# EAGLE design Motherboard (EAGLE 6.5.0)

## Sheet 1 of 6: Power
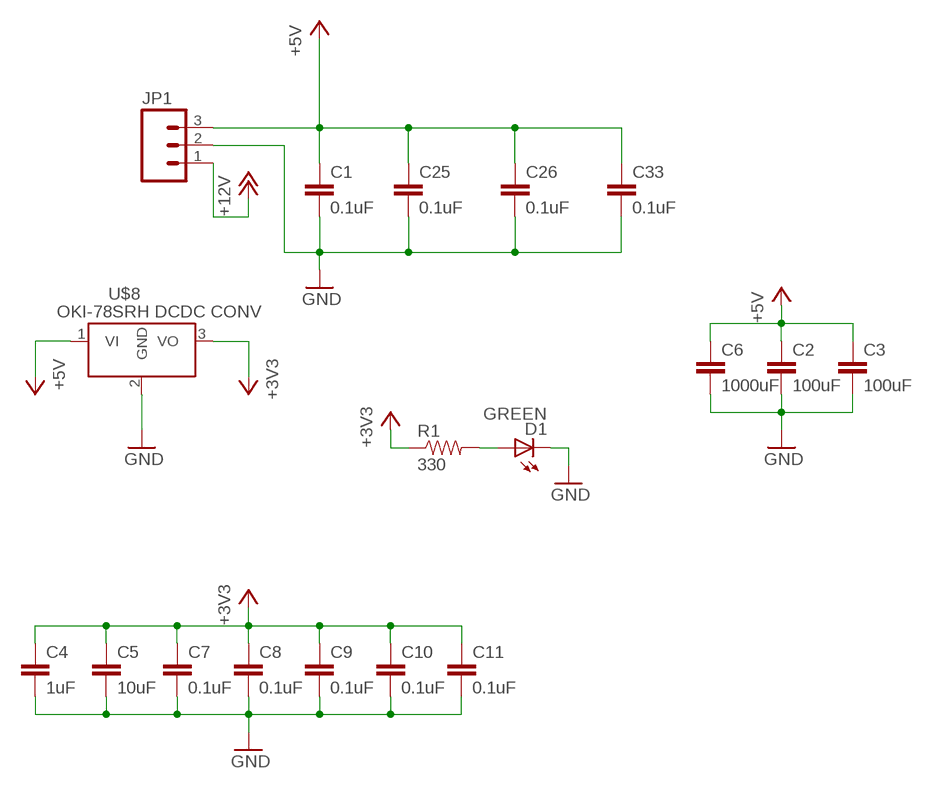
[diagram p0: schematic, sheet 1]

### Parts
C1  0.1uF  CAP1206  [1206]
C2  100uF  CAP1206  [1206]
C3  100uF  CAP1206  [1206]
C4  1uF  CAP1206  [1206]
C5  10uF  CAP1206  [1206]
C6  1000uF  CAP1206  [1206]
C7  0.1uF  CAP1206  [1206]
C8  0.1uF  CAP1206  [1206]
C9  0.1uF  CAP1206  [1206]
C10  0.1uF  CAP1206  [1206]
C11  0.1uF  CAP1206  [1206]
C25  0.1uF  CAP1206  [1206]
C26  0.1uF  CAP1206  [1206]
C33  0.1uF  CAP1206  [1206]
D1  GREEN  LED-GREENLARGE  [LED-1206]
JP1  M03SCREW  [SCREWTERMINAL-3.5MM-3]
R1  330  RESISTOR1206  [1206]
U$8  Q_OKI-78SR  [OKI-78SRH]

### Nets
5V: C1.1 C2.1 C3.1 C6.1 C25.1 C26.1 C33.1 JP1.3 U$8.1(VI) ; supply symbol labelled +5V ; also sheet 5
+3V3: C4.1 C5.1 C7.1 C8.1 C9.1 C10.1 C11.1 R1.1 U$8.3(VO) ; also sheet 3,4,5
+12V: JP1.1 ; also sheet 2
GND: C1.2 C2.2 C3.2 C4.2 C5.2 C6.2 C7.2 C8.2 C9.2 C10.2 C11.2 C25.2 C26.2 C33.2 D1.C JP1.2 U$8.2(GND) ; also sheet 2,3,4,5,6
N$45: D1.A R1.2

## Sheet 2 of 6: Fans
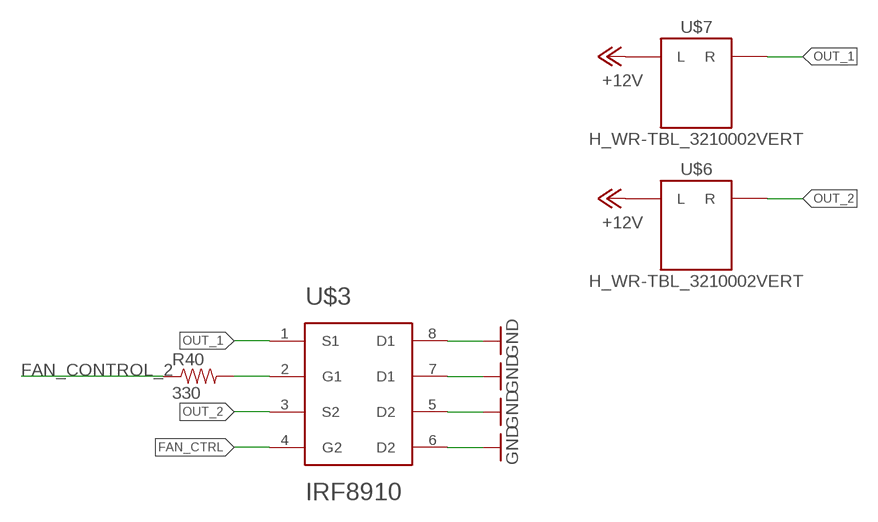
[diagram p1: schematic, sheet 2]

### Parts
R40  330  RESISTOR1206  [1206]
U$3  IRF8910  [SO8]
U$6  H_WR-TBL_3210002VERT  [691321100002]
U$7  H_WR-TBL_3210002VERT  [691321100002]

### Nets
+12V: U$6.L U$7.L ; also sheet 1
FAN_CONTROL_2: R40.1 ; also sheet 3
FAN_CTRL: R40.2 U$3.2(G1) U$3.4(G2)
GND: U$3.5(D2) U$3.6(D2) U$3.7(D1) U$3.8(D1) ; also sheet 1,3,4,5,6
OUT_1: U$3.1(S1) U$7.R
OUT_2: U$3.3(S2) U$6.R

## Sheet 3 of 6: Launchpad
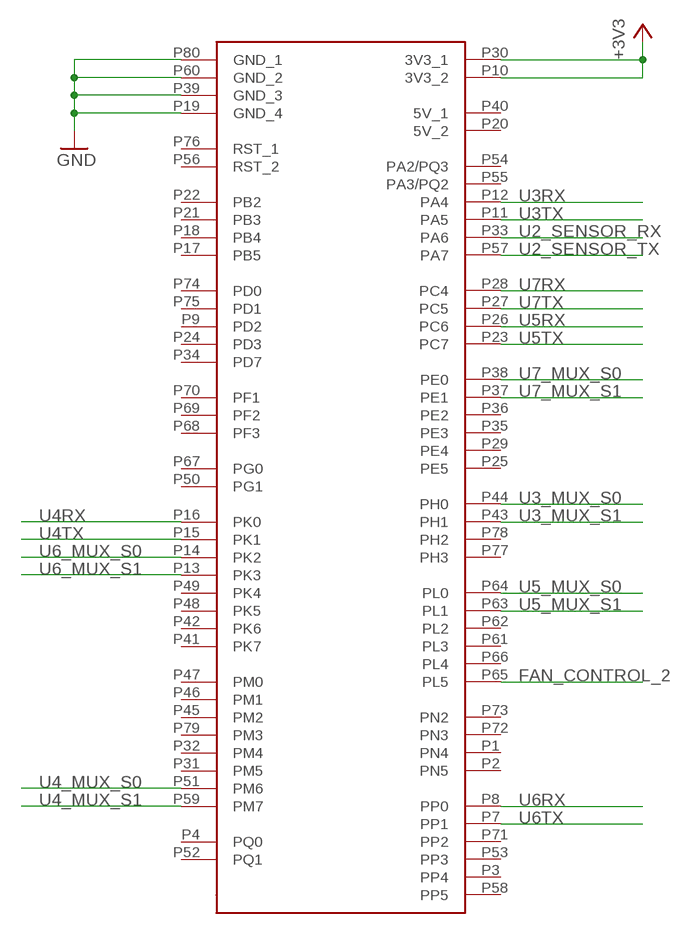
[diagram p2: schematic, sheet 3]

### Parts
U$5  STELLARISLAUNCHPAD_CONNECTED  [STELLARISLAUNCHPAD_CONNECTED]

### Nets
+3V3: U$5.P10(3V3_2) U$5.P30(3V3_1) ; also sheet 1,4,5
FAN_CONTROL_2: U$5.P65(PL5) ; also sheet 2
GND: U$5.P19(GND_4) U$5.P39(GND_3) U$5.P60(GND_2) U$5.P80(GND_1) ; also sheet 1,2,4,5,6
U2_SENSOR_RX: U$5.P33(PA6) ; also sheet 5
U2_SENSOR_TX: U$5.P57(PA7) ; also sheet 5
U3_MUX_S0: U$5.P44(PH0) ; also sheet 4
U3_MUX_S1: U$5.P43(PH1) ; also sheet 4
U3RX: U$5.P12(PA4) ; also sheet 4
U3TX: U$5.P11(PA5) ; also sheet 4
U4_MUX_S0: U$5.P51(PM6) ; also sheet 4
U4_MUX_S1: U$5.P59(PM7) ; also sheet 4
U4RX: U$5.P16(PK0) ; also sheet 4
U4TX: U$5.P15(PK1) ; also sheet 4
U5_MUX_S0: U$5.P64(PL0) ; also sheet 4
U5_MUX_S1: U$5.P63(PL1) ; also sheet 4
U5RX: U$5.P26(PC6) ; also sheet 4
U5TX: U$5.P23(PC7) ; also sheet 4
U6_MUX_S0: U$5.P14(PK2) ; also sheet 4
U6_MUX_S1: U$5.P13(PK3) ; also sheet 4
U6RX: U$5.P8(PP0) ; also sheet 4
U6TX: U$5.P7(PP1) ; also sheet 4
U7_MUX_S0: U$5.P38(PE0) ; also sheet 4
U7_MUX_S1: U$5.P37(PE1) ; also sheet 4
U7RX: U$5.P28(PC4) ; also sheet 4
U7TX: U$5.P27(PC5) ; also sheet 4
Unconnected: U$5.P1(PN4) U$5.P2(PN5) U$5.P3(PP4) U$5.P4(PQ0) U$5.P9(PD2) U$5.P17(PB5) U$5.P18(PB4) U$5.P20(5V_2) U$5.P21(PB3) U$5.P22(PB2) U$5.P24(PD3) U$5.P25(PE5) U$5.P29(PE4) U$5.P31(PM5) U$5.P32(PM4) U$5.P34(PD7) U$5.P35(PE3) U$5.P36(PE2) U$5.P40(5V_1) U$5.P41(PK7) U$5.P42(PK6) U$5.P45(PM2) U$5.P46(PM1) U$5.P47(PM0) U$5.P48(PK5) U$5.P49(PK4) U$5.P50(PG1) U$5.P52(PQ1) U$5.P53(PP3) U$5.P54(PA2/PQ3) U$5.P55(PA3/PQ2) U$5.P56(RST_2) U$5.P58(PP5) U$5.P61(PL3) U$5.P62(PL2) U$5.P66(PL4) U$5.P67(PG0) U$5.P68(PF3) U$5.P69(PF2) U$5.P70(PF1) U$5.P71(PP2) U$5.P72(PN3) U$5.P73(PN2) U$5.P74(PD0) U$5.P75(PD1) U$5.P76(RST_1) U$5.P77(PH3) U$5.P78(PH2) U$5.P79(PM3)

## Sheet 4 of 6: Muxes
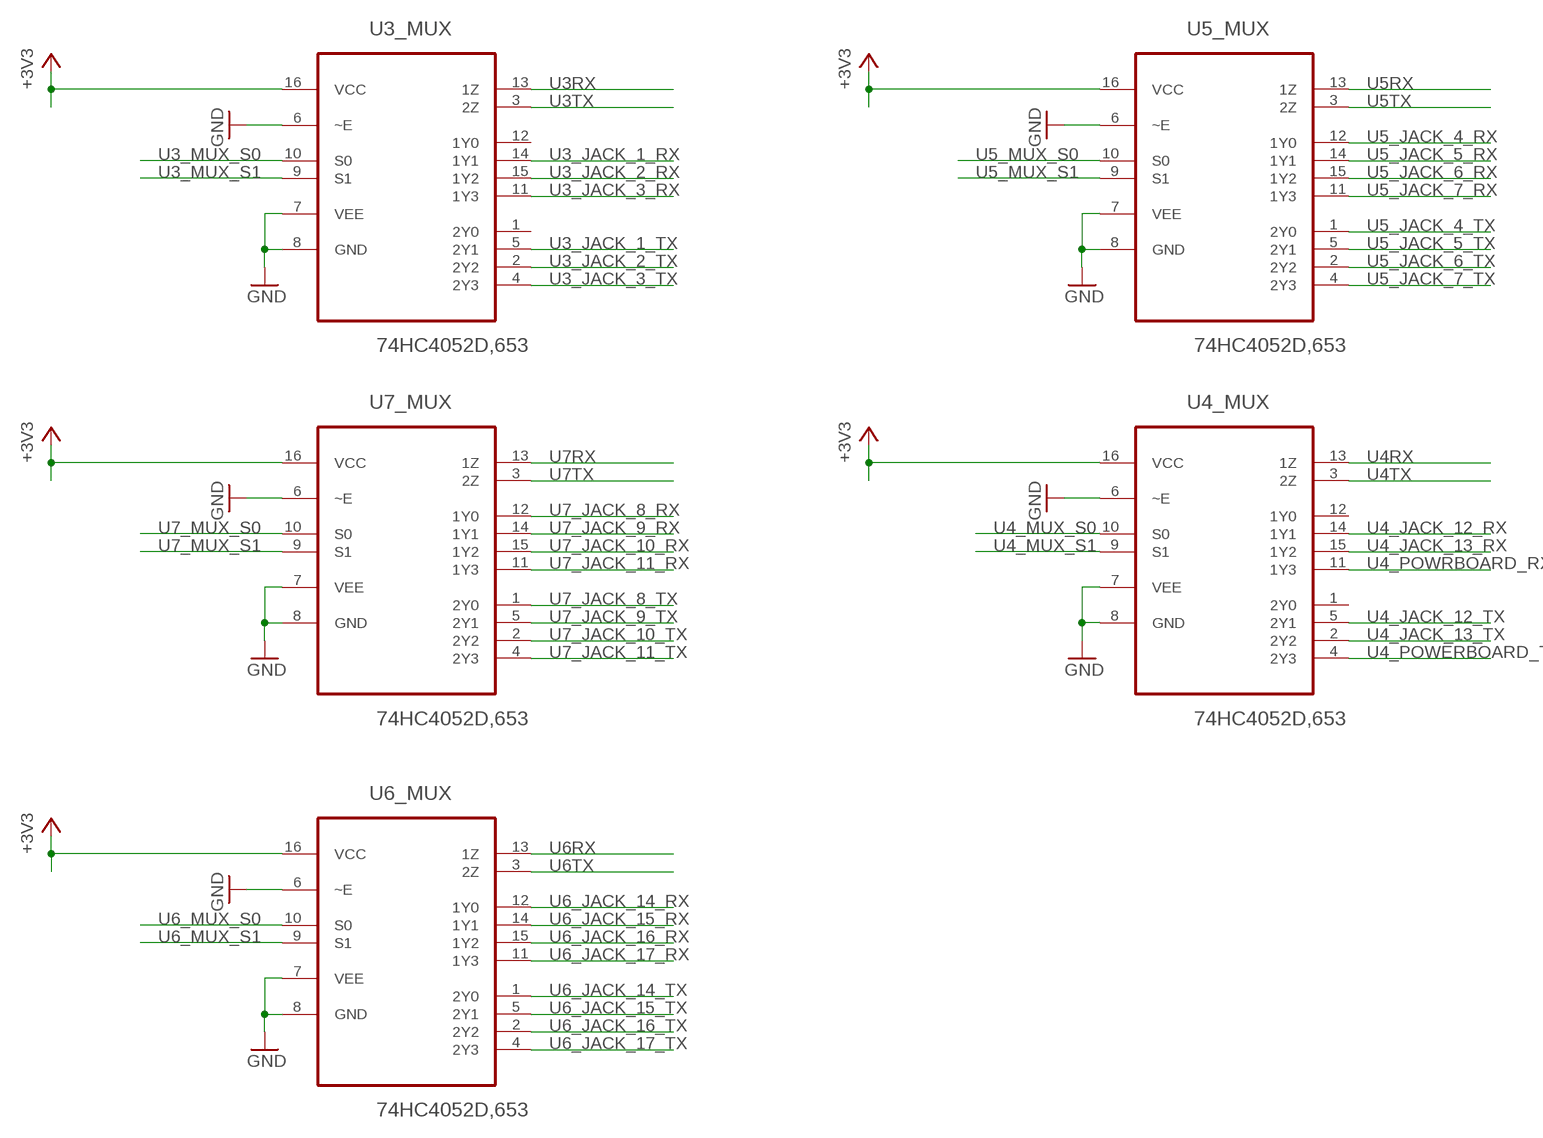
[diagram p3: schematic, sheet 4]

### Parts
U3_MUX  74HC4052D,653  [SOIC127P600X175-16N]
U4_MUX  74HC4052D,653  [SOIC127P600X175-16N]
U5_MUX  74HC4052D,653  [SOIC127P600X175-16N]
U6_MUX  74HC4052D,653  [SOIC127P600X175-16N]
U7_MUX  74HC4052D,653  [SOIC127P600X175-16N]

### Nets
+3V3: U3_MUX.16(VCC) U4_MUX.16(VCC) U5_MUX.16(VCC) U6_MUX.16(VCC) U7_MUX.16(VCC) ; also sheet 1,3,5
GND: U3_MUX.6(~E) U3_MUX.7(VEE) U3_MUX.8(GND) U4_MUX.6(~E) U4_MUX.7(VEE) U4_MUX.8(GND) U5_MUX.6(~E) U5_MUX.7(VEE) U5_MUX.8(GND) U6_MUX.6(~E) U6_MUX.7(VEE) U6_MUX.8(GND) U7_MUX.6(~E) U7_MUX.7(VEE) U7_MUX.8(GND) ; also sheet 1,2,3,5,6
U3_JACK_1_RX: U3_MUX.14(1Y1) ; also sheet 5
U3_JACK_1_TX: U3_MUX.5(2Y1) ; also sheet 5
U3_JACK_2_RX: U3_MUX.15(1Y2) ; also sheet 5
U3_JACK_2_TX: U3_MUX.2(2Y2) ; also sheet 5
U3_JACK_3_RX: U3_MUX.11(1Y3) ; also sheet 5
U3_JACK_3_TX: U3_MUX.4(2Y3) ; also sheet 5
U3_MUX_S0: U3_MUX.10(S0) ; also sheet 3
U3_MUX_S1: U3_MUX.9(S1) ; also sheet 3
U3RX: U3_MUX.13(1Z) ; also sheet 3
U3TX: U3_MUX.3(2Z) ; also sheet 3
U4_JACK_12_RX: U4_MUX.14(1Y1) ; also sheet 5
U4_JACK_12_TX: U4_MUX.5(2Y1) ; also sheet 5
U4_JACK_13_RX: U4_MUX.15(1Y2) ; also sheet 5
U4_JACK_13_TX: U4_MUX.2(2Y2) ; also sheet 5
U4_MUX_S0: U4_MUX.10(S0) ; also sheet 3
U4_MUX_S1: U4_MUX.9(S1) ; also sheet 3
U4_POWERBOARD_TX: U4_MUX.4(2Y3) ; also sheet 5
U4_POWRBOARD_RX: U4_MUX.11(1Y3) ; also sheet 5
U4RX: U4_MUX.13(1Z) ; also sheet 3
U4TX: U4_MUX.3(2Z) ; also sheet 3
U5_JACK_4_RX: U5_MUX.12(1Y0) ; also sheet 5
U5_JACK_4_TX: U5_MUX.1(2Y0) ; also sheet 5
U5_JACK_5_RX: U5_MUX.14(1Y1) ; also sheet 5
U5_JACK_5_TX: U5_MUX.5(2Y1) ; also sheet 5
U5_JACK_6_RX: U5_MUX.15(1Y2) ; also sheet 5
U5_JACK_6_TX: U5_MUX.2(2Y2) ; also sheet 5
U5_JACK_7_RX: U5_MUX.11(1Y3) ; also sheet 5
U5_JACK_7_TX: U5_MUX.4(2Y3) ; also sheet 5
U5_MUX_S0: U5_MUX.10(S0) ; also sheet 3
U5_MUX_S1: U5_MUX.9(S1) ; also sheet 3
U5RX: U5_MUX.13(1Z) ; also sheet 3
U5TX: U5_MUX.3(2Z) ; also sheet 3
U6_JACK_14_RX: U6_MUX.12(1Y0) ; also sheet 5
U6_JACK_14_TX: U6_MUX.1(2Y0) ; also sheet 5
U6_JACK_15_RX: U6_MUX.14(1Y1) ; also sheet 5
U6_JACK_15_TX: U6_MUX.5(2Y1) ; also sheet 5
U6_JACK_16_RX: U6_MUX.15(1Y2) ; also sheet 5
U6_JACK_16_TX: U6_MUX.2(2Y2) ; also sheet 5
U6_JACK_17_RX: U6_MUX.11(1Y3) ; also sheet 5
U6_JACK_17_TX: U6_MUX.4(2Y3) ; also sheet 5
U6_MUX_S0: U6_MUX.10(S0) ; also sheet 3
U6_MUX_S1: U6_MUX.9(S1) ; also sheet 3
U6RX: U6_MUX.13(1Z) ; also sheet 3
U6TX: U6_MUX.3(2Z) ; also sheet 3
U7_JACK_8_RX: U7_MUX.12(1Y0) ; also sheet 5
U7_JACK_8_TX: U7_MUX.1(2Y0) ; also sheet 5
U7_JACK_9_RX: U7_MUX.14(1Y1) ; also sheet 5
U7_JACK_9_TX: U7_MUX.5(2Y1) ; also sheet 5
U7_JACK_10_RX: U7_MUX.15(1Y2) ; also sheet 5
U7_JACK_10_TX: U7_MUX.2(2Y2) ; also sheet 5
U7_JACK_11_RX: U7_MUX.11(1Y3) ; also sheet 5
U7_JACK_11_TX: U7_MUX.4(2Y3) ; also sheet 5
U7_MUX_S0: U7_MUX.10(S0) ; also sheet 3
U7_MUX_S1: U7_MUX.9(S1) ; also sheet 3
U7RX: U7_MUX.13(1Z) ; also sheet 3
U7TX: U7_MUX.3(2Z) ; also sheet 3
Unconnected: U3_MUX.1(2Y0) U3_MUX.12(1Y0) U4_MUX.1(2Y0) U4_MUX.12(1Y0)

## Sheet 5 of 6: RS-485 External
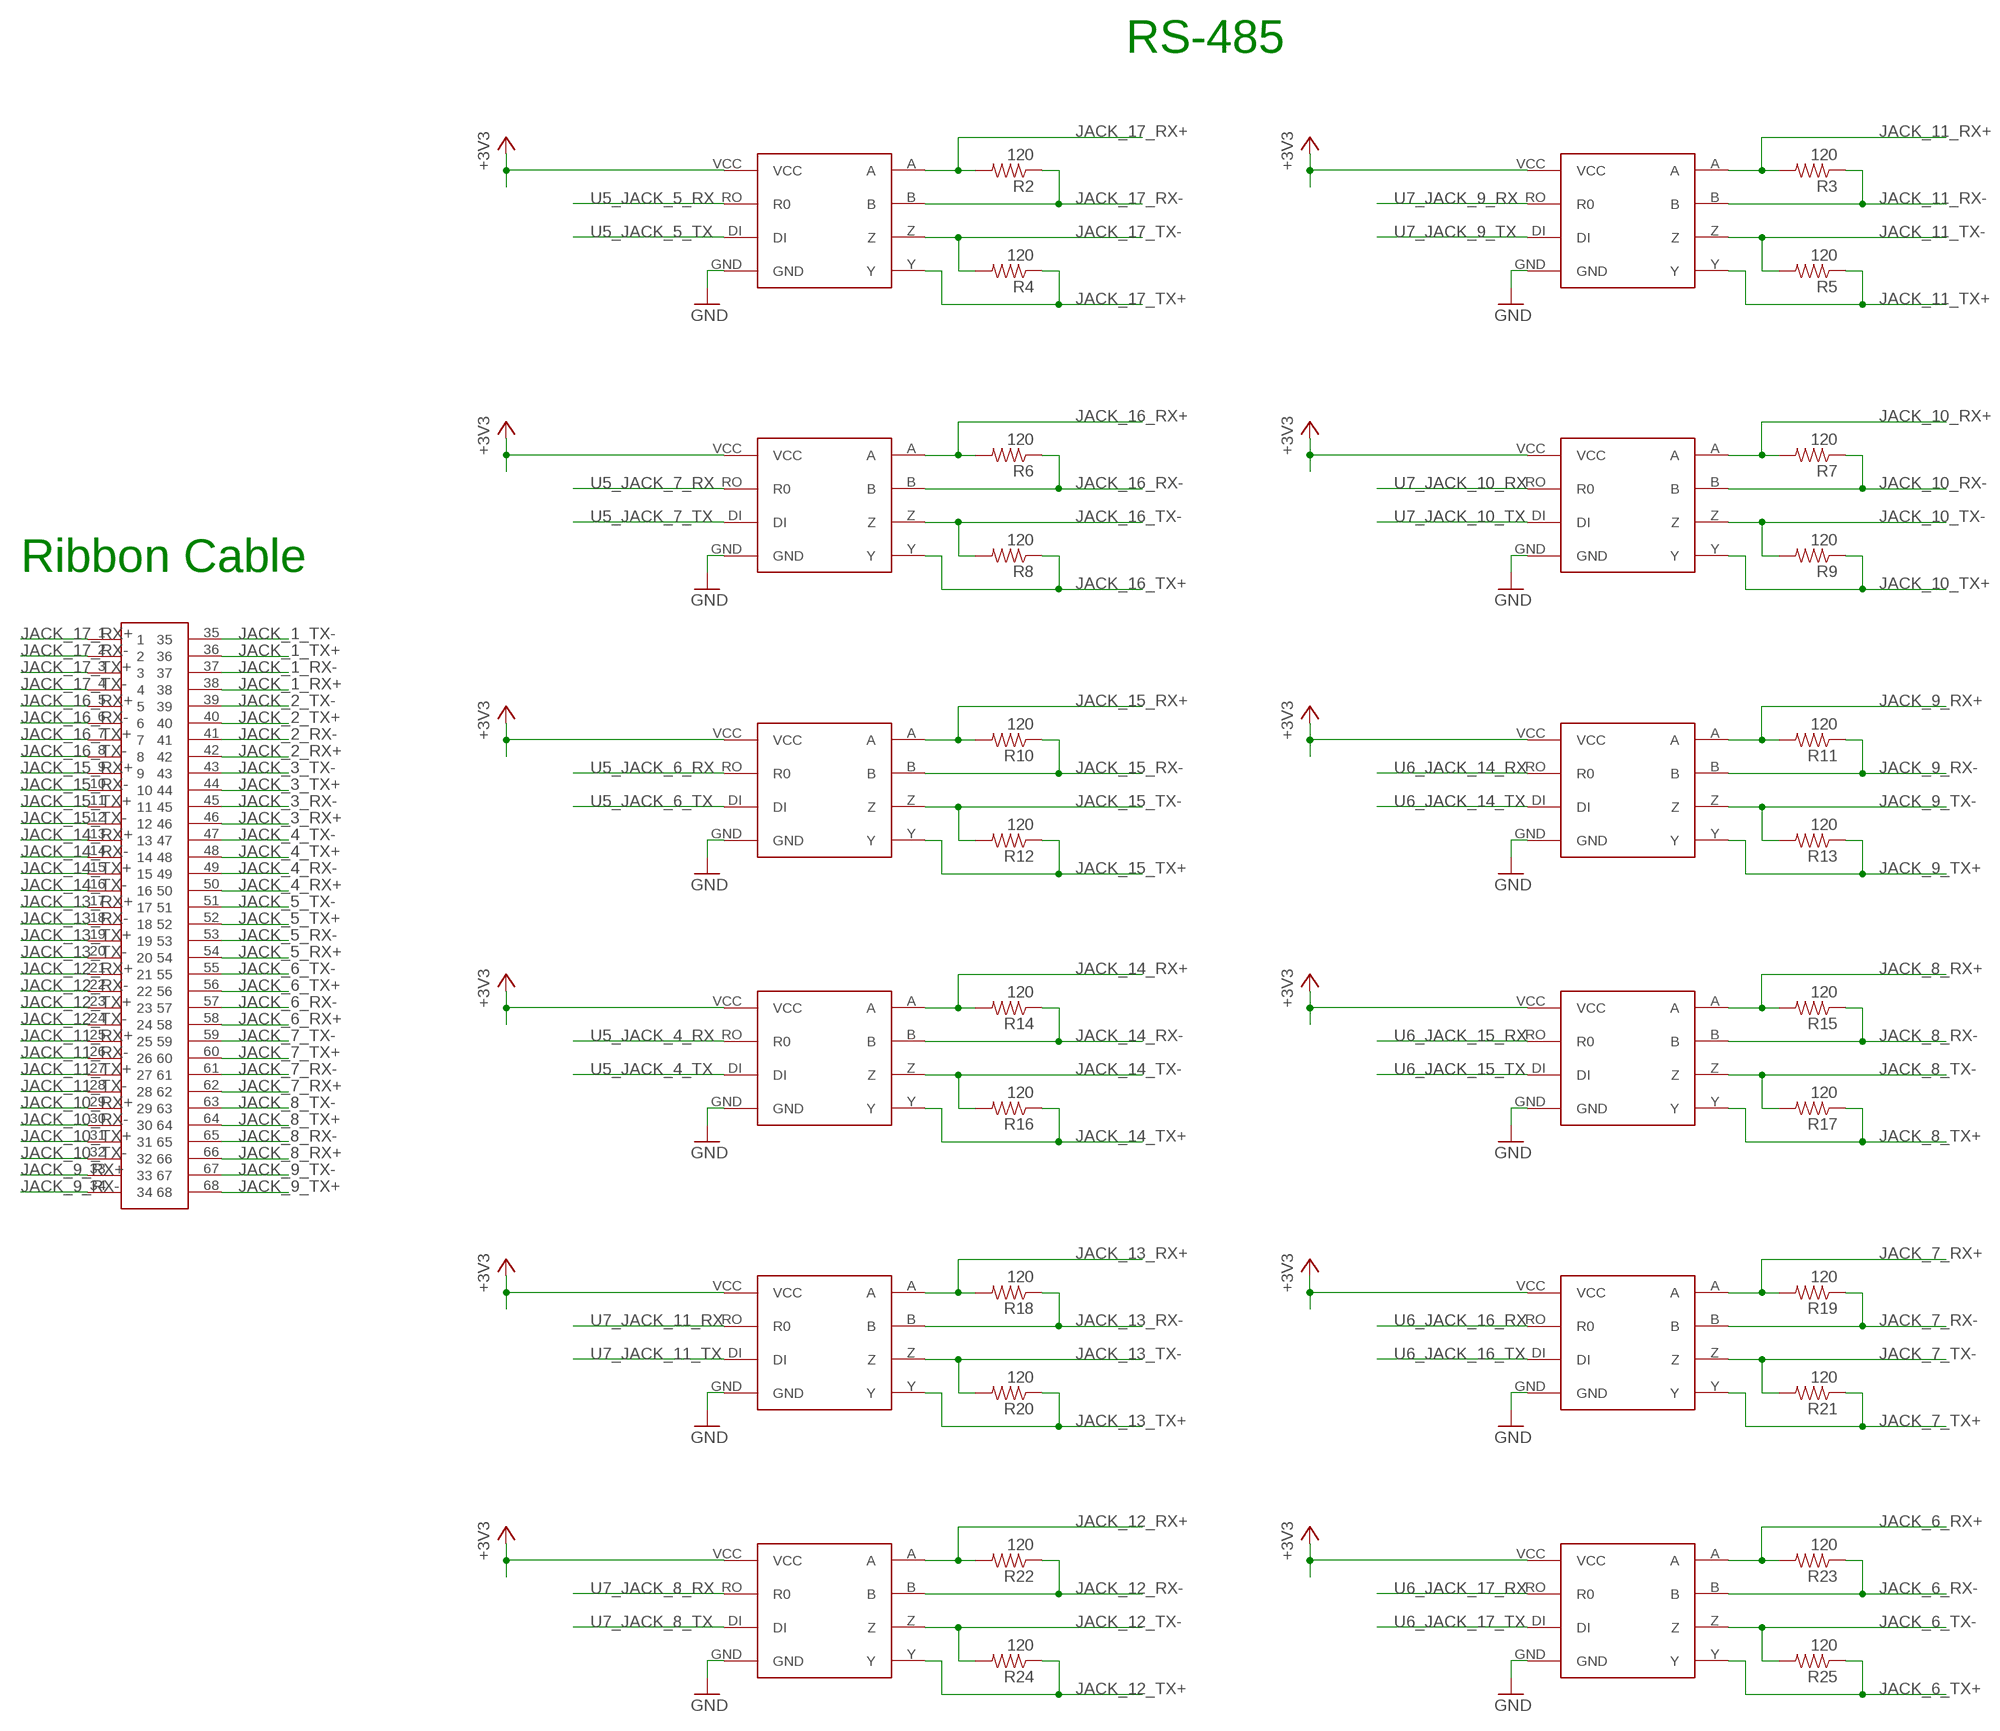
[diagram p4: schematic, sheet 5, part 1 of 2]
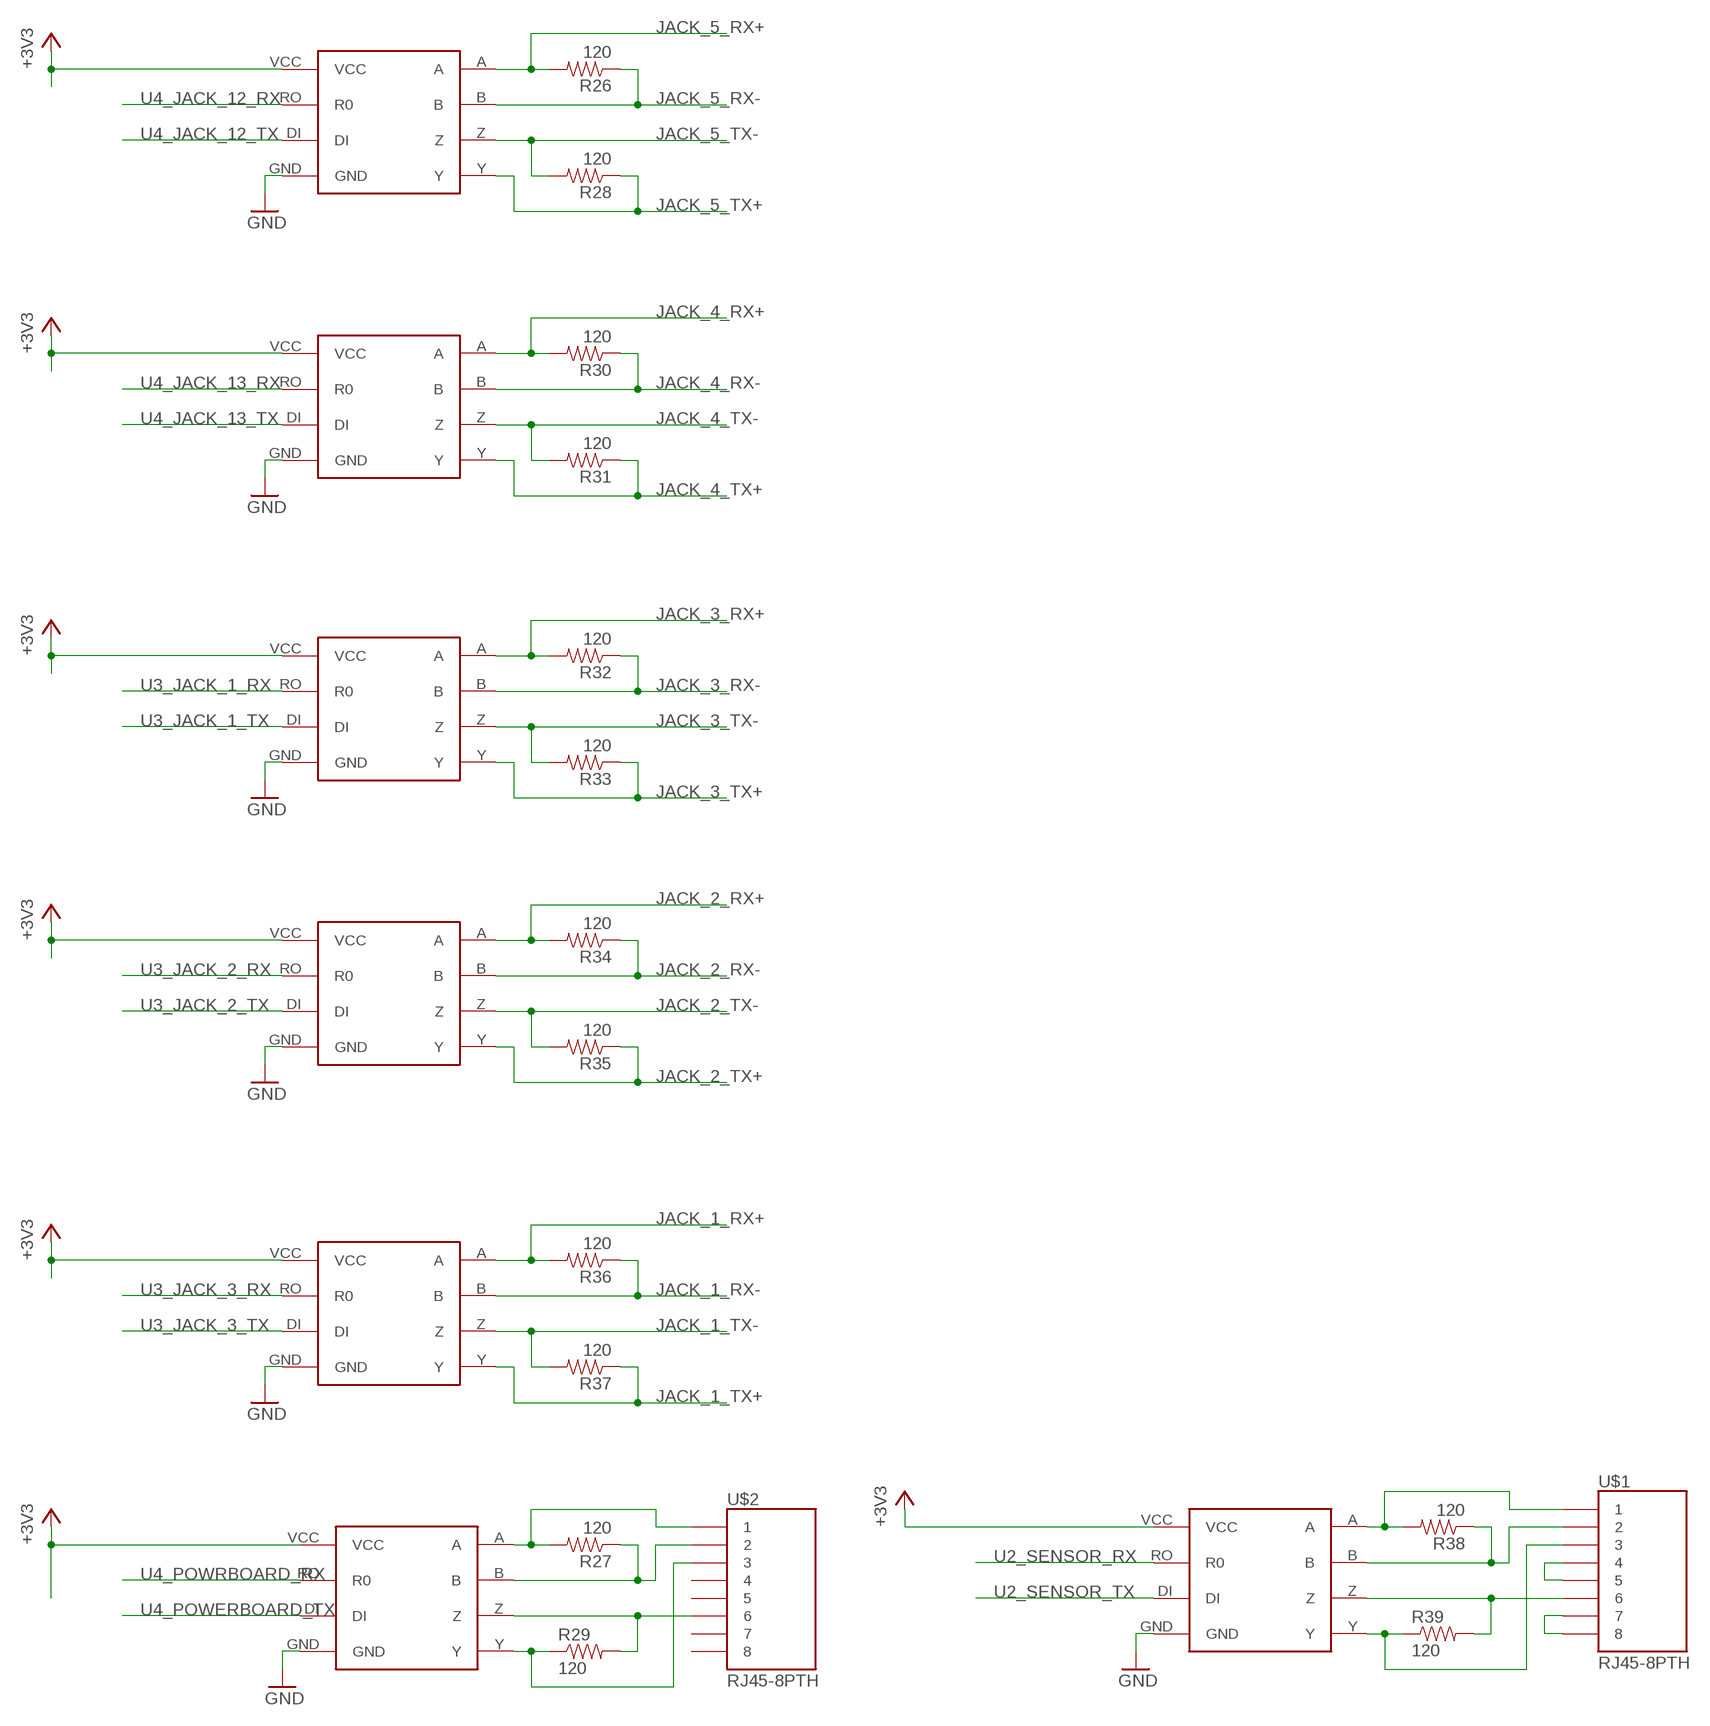
[diagram p5: schematic, sheet 5, part 2 of 2]

### Parts
R2  120  RESISTOR1206  [1206]
R3  120  RESISTOR1206  [1206]
R4  120  RESISTOR1206  [1206]
R5  120  RESISTOR1206  [1206]
R6  120  RESISTOR1206  [1206]
R7  120  RESISTOR1206  [1206]
R8  120  RESISTOR1206  [1206]
R9  120  RESISTOR1206  [1206]
R10  120  RESISTOR1206  [1206]
R11  120  RESISTOR1206  [1206]
R12  120  RESISTOR1206  [1206]
R13  120  RESISTOR1206  [1206]
R14  120  RESISTOR1206  [1206]
R15  120  RESISTOR1206  [1206]
R16  120  RESISTOR1206  [1206]
R17  120  RESISTOR1206  [1206]
R18  120  RESISTOR1206  [1206]
R19  120  RESISTOR1206  [1206]
R20  120  RESISTOR1206  [1206]
R21  120  RESISTOR1206  [1206]
R22  120  RESISTOR1206  [1206]
R23  120  RESISTOR1206  [1206]
R24  120  RESISTOR1206  [1206]
R25  120  RESISTOR1206  [1206]
R26  120  RESISTOR1206  [1206]
R27  120  RESISTOR1206  [1206]
R28  120  RESISTOR1206  [1206]
R29  120  RESISTOR1206  [1206]
R30  120  RESISTOR1206  [1206]
R31  120  RESISTOR1206  [1206]
R32  120  RESISTOR1206  [1206]
R33  120  RESISTOR1206  [1206]
R34  120  RESISTOR1206  [1206]
R35  120  RESISTOR1206  [1206]
R36  120  RESISTOR1206  [1206]
R37  120  RESISTOR1206  [1206]
R38  120  RESISTOR1206  [1206]
R39  120  RESISTOR1206  [1206]
RS-485-1  MAX3077  [MAX3070E]
RS-485-2  MAX3077  [MAX3070E]
RS_TRANS_1  MAX3077  [MAX3070E]
RS_TRANS_2  MAX3077  [MAX3070E]
RS_TRANS_3  MAX3077  [MAX3070E]
RS_TRANS_4  MAX3077  [MAX3070E]
RS_TRANS_5  MAX3077  [MAX3070E]
RS_TRANS_6  MAX3077  [MAX3070E]
RS_TRANS_7  MAX3077  [MAX3070E]
RS_TRANS_8  MAX3077  [MAX3070E]
RS_TRANS_9  MAX3077  [MAX3070E]
RS_TRANS_10  MAX3077  [MAX3070E]
RS_TRANS_11  MAX3077  [MAX3070E]
RS_TRANS_12  MAX3077  [MAX3070E]
RS_TRANS_13  MAX3077  [MAX3070E]
RS_TRANS_14  MAX3077  [MAX3070E]
RS_TRANS_15  MAX3077  [MAX3070E]
RS_TRANS_16  MAX3077  [MAX3070E]
RS_TRANS_17  MAX3077  [MAX3070E]
U$1  RJ45-8PTH  [RJ45-8]
U$2  RJ45-8PTH  [RJ45-8]
U$4  TB60050685100  [60050685100]

### Nets
5V: U$1.4 U$1.5 ; also sheet 1
18_RX+: R27.2 RS-485-2.A U$2.1
18_RX+1: R38.2 RS-485-1.A U$1.1
18_RX-: R27.1 RS-485-2.B U$2.2
18_RX-1: R38.1 RS-485-1.B U$1.2
18_TX+: R29.1 RS-485-2.Y U$2.3
18_TX+1: R39.1 RS-485-1.Y U$1.3
18_TX-: R29.2 RS-485-2.Z U$2.6
18_TX-1: R39.2 RS-485-1.Z U$1.6
+3V3: RS-485-1.VCC RS-485-2.VCC RS_TRANS_1.VCC RS_TRANS_2.VCC RS_TRANS_3.VCC RS_TRANS_4.VCC RS_TRANS_5.VCC RS_TRANS_6.VCC RS_TRANS_7.VCC RS_TRANS_8.VCC RS_TRANS_9.VCC RS_TRANS_10.VCC RS_TRANS_11.VCC RS_TRANS_12.VCC RS_TRANS_13.VCC RS_TRANS_14.VCC RS_TRANS_15.VCC RS_TRANS_16.VCC RS_TRANS_17.VCC ; also sheet 1,3,4
GND: RS-485-1.GND RS-485-2.GND RS_TRANS_1.GND RS_TRANS_2.GND RS_TRANS_3.GND RS_TRANS_4.GND RS_TRANS_5.GND RS_TRANS_6.GND RS_TRANS_7.GND RS_TRANS_8.GND RS_TRANS_9.GND RS_TRANS_10.GND RS_TRANS_11.GND RS_TRANS_12.GND RS_TRANS_13.GND RS_TRANS_14.GND RS_TRANS_15.GND RS_TRANS_16.GND RS_TRANS_17.GND U$1.7 U$1.8 ; also sheet 1,2,3,4,6
JACK_1_RX+: R36.2 RS_TRANS_17.A U$4.38
JACK_1_RX-: R36.1 RS_TRANS_17.B U$4.37
JACK_1_TX+: R37.1 RS_TRANS_17.Y U$4.36
JACK_1_TX-: R37.2 RS_TRANS_17.Z U$4.35
JACK_2_RX+: R34.2 RS_TRANS_16.A U$4.42
JACK_2_RX-: R34.1 RS_TRANS_16.B U$4.41
JACK_2_TX+: R35.1 RS_TRANS_16.Y U$4.40
JACK_2_TX-: R35.2 RS_TRANS_16.Z U$4.39
JACK_3_RX+: R32.2 RS_TRANS_15.A U$4.46
JACK_3_RX-: R32.1 RS_TRANS_15.B U$4.45
JACK_3_TX+: R33.1 RS_TRANS_15.Y U$4.44
JACK_3_TX-: R33.2 RS_TRANS_15.Z U$4.43
JACK_4_RX+: R30.2 RS_TRANS_14.A U$4.50
JACK_4_RX-: R30.1 RS_TRANS_14.B U$4.49
JACK_4_TX+: R31.1 RS_TRANS_14.Y U$4.48
JACK_4_TX-: R31.2 RS_TRANS_14.Z U$4.47
JACK_5_RX+: R26.2 RS_TRANS_13.A U$4.54
JACK_5_RX-: R26.1 RS_TRANS_13.B U$4.53
JACK_5_TX+: R28.1 RS_TRANS_13.Y U$4.52
JACK_5_TX-: R28.2 RS_TRANS_13.Z U$4.51
JACK_6_RX+: R23.2 RS_TRANS_12.A U$4.58
JACK_6_RX-: R23.1 RS_TRANS_12.B U$4.57
JACK_6_TX+: R25.1 RS_TRANS_12.Y U$4.56
JACK_6_TX-: R25.2 RS_TRANS_12.Z U$4.55
JACK_7_RX+: R19.2 RS_TRANS_10.A U$4.62
JACK_7_RX-: R19.1 RS_TRANS_10.B U$4.61
JACK_7_TX+: R21.1 RS_TRANS_10.Y U$4.60
JACK_7_TX-: R21.2 RS_TRANS_10.Z U$4.59
JACK_8_RX+: R15.2 RS_TRANS_8.A U$4.66
JACK_8_RX-: R15.1 RS_TRANS_8.B U$4.65
JACK_8_TX+: R17.1 RS_TRANS_8.Y U$4.64
JACK_8_TX-: R17.2 RS_TRANS_8.Z U$4.63
JACK_9_RX+: R11.2 RS_TRANS_6.A U$4.33
JACK_9_RX-: R11.1 RS_TRANS_6.B U$4.34
JACK_9_TX+: R13.1 RS_TRANS_6.Y U$4.68
JACK_9_TX-: R13.2 RS_TRANS_6.Z U$4.67
JACK_10_RX+: R7.2 RS_TRANS_4.A U$4.29
JACK_10_RX-: R7.1 RS_TRANS_4.B U$4.30
JACK_10_TX+: R9.1 RS_TRANS_4.Y U$4.31
JACK_10_TX-: R9.2 RS_TRANS_4.Z U$4.32
JACK_11_RX+: R3.2 RS_TRANS_2.A U$4.25
JACK_11_RX-: R3.1 RS_TRANS_2.B U$4.26
JACK_11_TX+: R5.1 RS_TRANS_2.Y U$4.27
JACK_11_TX-: R5.2 RS_TRANS_2.Z U$4.28
JACK_12_RX+: R22.2 RS_TRANS_11.A U$4.21
JACK_12_RX-: R22.1 RS_TRANS_11.B U$4.22
JACK_12_TX+: R24.1 RS_TRANS_11.Y U$4.23
JACK_12_TX-: R24.2 RS_TRANS_11.Z U$4.24
JACK_13_RX+: R18.2 RS_TRANS_9.A U$4.17
JACK_13_RX-: R18.1 RS_TRANS_9.B U$4.18
JACK_13_TX+: R20.1 RS_TRANS_9.Y U$4.19
JACK_13_TX-: R20.2 RS_TRANS_9.Z U$4.20
JACK_14_RX+: R14.2 RS_TRANS_7.A U$4.13
JACK_14_RX-: R14.1 RS_TRANS_7.B U$4.14
JACK_14_TX+: R16.1 RS_TRANS_7.Y U$4.15
JACK_14_TX-: R16.2 RS_TRANS_7.Z U$4.16
JACK_15_RX+: R10.2 RS_TRANS_5.A U$4.9
JACK_15_RX-: R10.1 RS_TRANS_5.B U$4.10
JACK_15_TX+: R12.1 RS_TRANS_5.Y U$4.11
JACK_15_TX-: R12.2 RS_TRANS_5.Z U$4.12
JACK_16_RX+: R6.2 RS_TRANS_3.A U$4.5
JACK_16_RX-: R6.1 RS_TRANS_3.B U$4.6
JACK_16_TX+: R8.1 RS_TRANS_3.Y U$4.7
JACK_16_TX-: R8.2 RS_TRANS_3.Z U$4.8
JACK_17_RX+: R2.2 RS_TRANS_1.A U$4.1
JACK_17_RX-: R2.1 RS_TRANS_1.B U$4.2
JACK_17_TX+: R4.1 RS_TRANS_1.Y U$4.3
JACK_17_TX-: R4.2 RS_TRANS_1.Z U$4.4
U2_SENSOR_RX: RS-485-1.RO(R0) ; also sheet 3
U2_SENSOR_TX: RS-485-1.DI ; also sheet 3
U3_JACK_1_RX: RS_TRANS_15.RO(R0) ; also sheet 4
U3_JACK_1_TX: RS_TRANS_15.DI ; also sheet 4
U3_JACK_2_RX: RS_TRANS_16.RO(R0) ; also sheet 4
U3_JACK_2_TX: RS_TRANS_16.DI ; also sheet 4
U3_JACK_3_RX: RS_TRANS_17.RO(R0) ; also sheet 4
U3_JACK_3_TX: RS_TRANS_17.DI ; also sheet 4
U4_JACK_12_RX: RS_TRANS_13.RO(R0) ; also sheet 4
U4_JACK_12_TX: RS_TRANS_13.DI ; also sheet 4
U4_JACK_13_RX: RS_TRANS_14.RO(R0) ; also sheet 4
U4_JACK_13_TX: RS_TRANS_14.DI ; also sheet 4
U4_POWERBOARD_TX: RS-485-2.DI ; also sheet 4
U4_POWRBOARD_RX: RS-485-2.RO(R0) ; also sheet 4
U5_JACK_4_RX: RS_TRANS_7.RO(R0) ; also sheet 4
U5_JACK_4_TX: RS_TRANS_7.DI ; also sheet 4
U5_JACK_5_RX: RS_TRANS_1.RO(R0) ; also sheet 4
U5_JACK_5_TX: RS_TRANS_1.DI ; also sheet 4
U5_JACK_6_RX: RS_TRANS_5.RO(R0) ; also sheet 4
U5_JACK_6_TX: RS_TRANS_5.DI ; also sheet 4
U5_JACK_7_RX: RS_TRANS_3.RO(R0) ; also sheet 4
U5_JACK_7_TX: RS_TRANS_3.DI ; also sheet 4
U6_JACK_14_RX: RS_TRANS_6.RO(R0) ; also sheet 4
U6_JACK_14_TX: RS_TRANS_6.DI ; also sheet 4
U6_JACK_15_RX: RS_TRANS_8.RO(R0) ; also sheet 4
U6_JACK_15_TX: RS_TRANS_8.DI ; also sheet 4
U6_JACK_16_RX: RS_TRANS_10.RO(R0) ; also sheet 4
U6_JACK_16_TX: RS_TRANS_10.DI ; also sheet 4
U6_JACK_17_RX: RS_TRANS_12.RO(R0) ; also sheet 4
U6_JACK_17_TX: RS_TRANS_12.DI ; also sheet 4
U7_JACK_8_RX: RS_TRANS_11.RO(R0) ; also sheet 4
U7_JACK_8_TX: RS_TRANS_11.DI ; also sheet 4
U7_JACK_9_RX: RS_TRANS_2.RO(R0) ; also sheet 4
U7_JACK_9_TX: RS_TRANS_2.DI ; also sheet 4
U7_JACK_10_RX: RS_TRANS_4.RO(R0) ; also sheet 4
U7_JACK_10_TX: RS_TRANS_4.DI ; also sheet 4
U7_JACK_11_RX: RS_TRANS_9.RO(R0) ; also sheet 4
U7_JACK_11_TX: RS_TRANS_9.DI ; also sheet 4
Unconnected: U$2.4 U$2.5 U$2.7 U$2.8

### Notes on the sheet
- RS-485
- Ribbon Cable

## Sheet 6 of 6: Holes
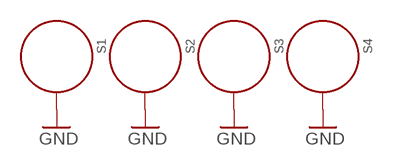
[diagram p6: schematic, sheet 6]

### Parts
S1  STANDOFF_ELECTRICAL  [STANDOFF-ELECTRICAL]
S2  STANDOFF_ELECTRICAL  [STANDOFF-ELECTRICAL]
S3  STANDOFF_ELECTRICAL  [STANDOFF-ELECTRICAL]
S4  STANDOFF_ELECTRICAL  [STANDOFF-ELECTRICAL]

### Nets
GND: S1.P1 S2.P1 S3.P1 S4.P1 ; also sheet 1,2,3,4,5

## Library data of the parts
C1-C11 C25 C26 C33 = SparkFun-Passives:CAP: Capacitor Standard 0603 ceramic capacitor, and 0.1" leaded capacitor.
D1 = SparkFun-LED:LED-GREEN: Various green LEDs 0603- DIO-00821 LARGE- DIO-00862 LILYPAD- DIO-09910; PROD_ID: DIO-00862
JP1 = SparkFun-Connectors:M03: Header 3 Standard 3-pin 0.1" header. Use with straight break away headers (SKU : PRT-00116), right angle break away headers (PRT-00553), swiss pins (PRT-00743), machine pins (PRT-00117), and female headers (PRT-00115). Molex polarized connector foot print use with SKU : PRT-08232 with associated crimp pins and housings.
R1-R40 = SparkFun-Passives:RESISTOR: Resistor Basic schematic elements and footprints for 0603, 1206, and PTH resistors.
RS-485-1 RS-485-2 RS_TRANS_1-RS_TRANS_17 = MAX3077:MAX3077
S1-S4 = SparkFun-Electromechanical:STANDOFF_ELECTRICAL: A standoff intended to be an electrically connected point. Pad size and stop size allow for a #4 Phillips pan screw head to make a solid connection to the board.
U3_MUX U4_MUX U5_MUX U6_MUX U7_MUX = 4x1_Dual_Mux:74HC4052D,653: Dual 4-channel analog multiplexer/demultiplexer; MPN: 74HC4052D,653; OC_FARNELL: 1826642; OC_NEWARK: 78R7402; PACKAGE: SO-16; SUPPLIER: NXP
U$1 U$2 = SparkFun-Connectors:RJ45-8: RJ45 Jack Simple RJ45, 8-pin connection - connector for common Cat5, Cat5e, and Cat6 Ethernet cables. Footprint not yet proven in production. Connector sku is PRT-00643; Breakout PCB sku is BOB-00716.
U$3 = MRDT-2015-General:IRF8910
U$4 = harting-scsi:TB60050685100
U$5 = StellarisLaunchPadConnected:STELLARISLAUNCHPAD_CONNECTED
U$6 U$7 = MRDT-2015-PowerBoard:H_WR-TBL_32*1*0002: Wurth Electronic's 2-pin 10A pluggable screw terminal headers. Vertical and Horizantal Part Numbers: 691322110002 (Horizantal) 691321100002 (Vertical); DIGIKEY_PN: 732-2763-ND
U$8 = MRDT-2015-PowerBoard:Q_OKI-78SR: 4.95W DC/DC Converter Manufacturer: Murata Part Number: OKI-78SR-5/1.5-W36H-C OKI-78SR-3.3/1.5-W36H-C

## Board
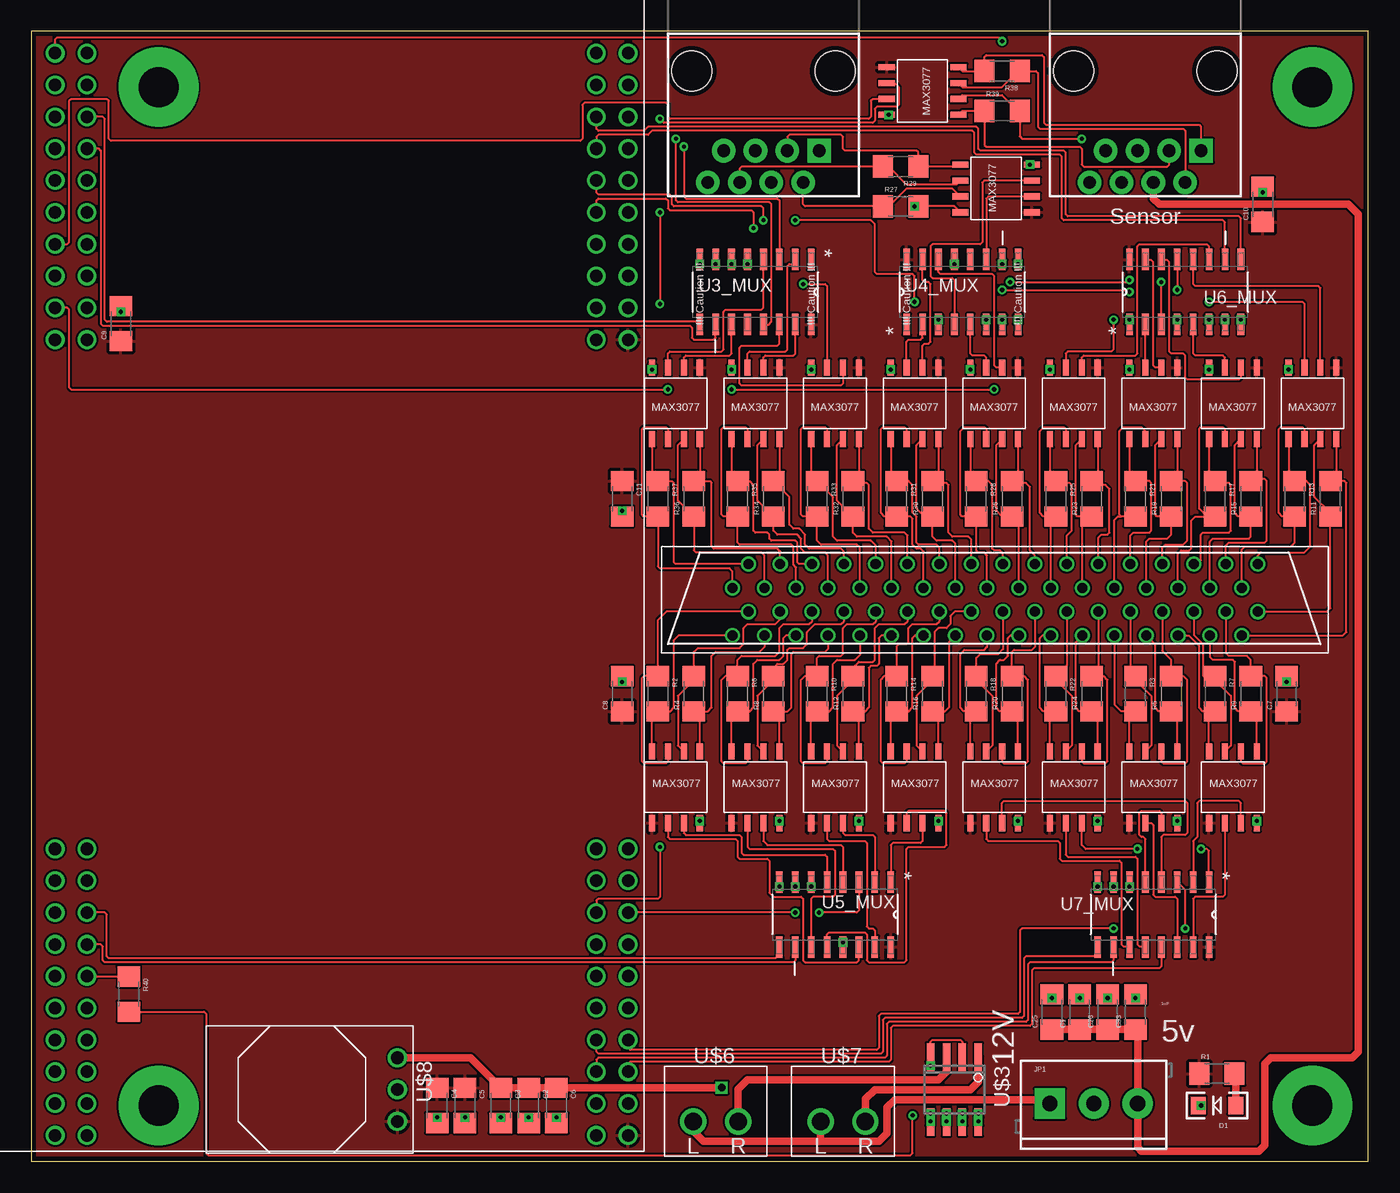
[diagram p7: board, top side]
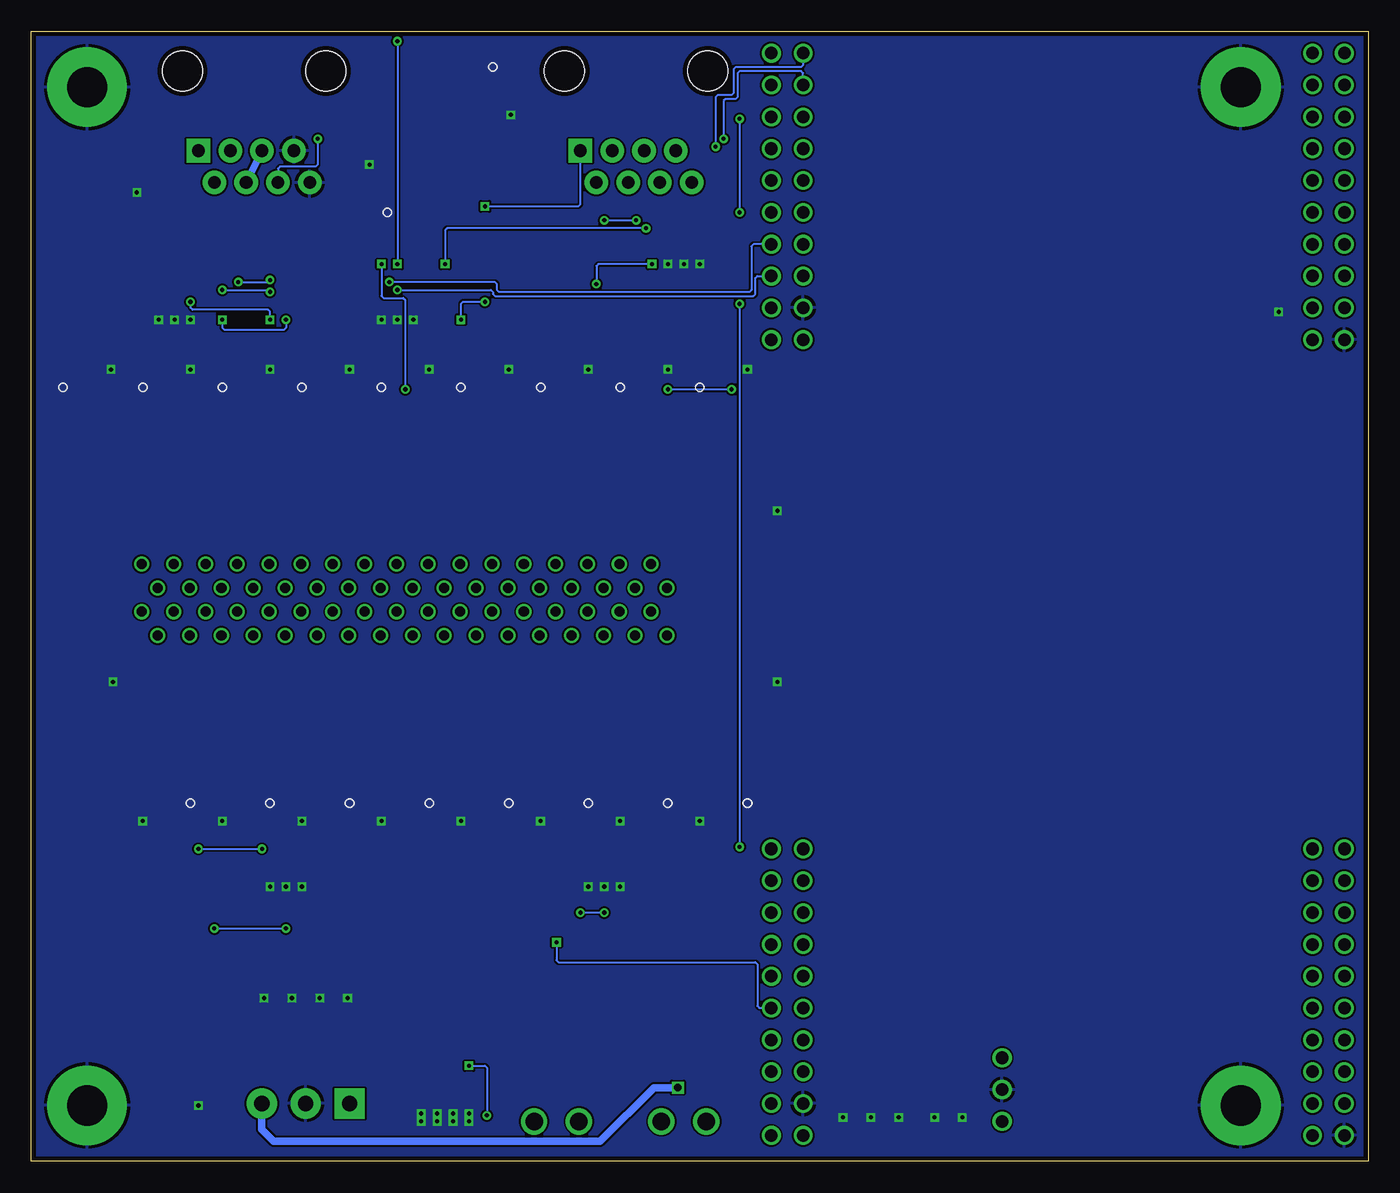
[diagram p8: board, bottom side, seen from below]

Size 106.68 x 90.17 mm. Coordinates in mm from the lower left corner, seen from the top.
Outline: 0,90.17 0,0 106.68,0 106.68,90.17 0,90.17
Copper layers (1*16): Top 0.0356mm / dielectric 1.5011mm / Bottom 0.0356mm
Design rules "LaenPCBOrder": minimum track width 6mil, minimum drill 13mil, track to track 6mil, track to pad 6mil, pad to pad 6mil, via to via 6mil, smd to smd 6mil, copper to edge 15mil, drill to drill 6mil, minimum pad ring 7mil, minimum via ring 7mil, stop-mask expansion 3mil, vias tented up to drill 0mil, thermal gap 10mil

### Footprints (pad centres in the part's own frame; a part is rotated, then mirrored left to right if it is on the bottom)
1206 = smd 1.6 x 1.8: 1 -1.4,0; 2 1.4,0
LED-1206 = smd 1.2 x 1.4: A -1.5,0; C 1.5,0
SCREWTERMINAL-3.5MM-3 = drill 1.2 pad 2.413 square: 1 0,0 | drill 1.2 pad 2.413: 2 3.5,0; 3 7,0
MAX3070E = smd 0.49 x 1.3: A -1.905,2.857; B -0.635,2.857; DI 0.635,-2.857; GND 1.905,-2.857; RO -0.635,-2.857; VCC -1.905,-2.857; Y 1.905,2.857; Z 0.635,2.857
STANDOFF-ELECTRICAL = drill 3.2 pad 6.35: P1 0,0
SOIC127P600X175-16N = smd 1.702 x 0.533: 1 -2.591,4.445; 2 -2.591,3.175; 3 -2.591,1.905; 4 -2.591,0.635; 5 -2.591,-0.635; 6 -2.591,-1.905; 7 -2.591,-3.175; 8 -2.591,-4.445; 9 2.591,-4.445; 10 2.591,-3.175; 11 2.591,-1.905; 12 2.591,-0.635; 13 2.591,0.635; 14 2.591,1.905; 15 2.591,3.175; 16 2.591,4.445
RJ45-8 = drill 1 pad 1.88 square: 1 -4.445,6.35 | drill 1 pad 1.88: 2 -3.175,8.89; 3 -1.905,6.35; 4 -0.635,8.89; 5 0.635,6.35; 6 1.905,8.89; 7 3.175,6.35; 8 4.445,8.89 | hole 3.2: -5.715,0; 5.715,0
SO8 = smd 0.6 x 2.2: 1 -1.905,-2.6; 2 -0.635,-2.6; 3 0.635,-2.6; 4 1.905,-2.6; 5 1.905,2.6; 6 0.635,2.6; 7 -0.635,2.6; 8 -1.905,2.6
60050685100 = drill 0.8: 1 47.555,7.107; 2 46.285,5.202; 3 45.015,7.107; 4 43.745,5.202; 5 42.475,7.107; 6 41.205,5.202; 7 39.935,7.107; 8 38.665,5.202; 9 37.395,7.107; 10 36.125,5.202; 11 34.855,7.107; 12 33.585,5.202; 13 32.315,7.107; 14 31.045,5.202; 15 29.775,7.107; 16 28.505,5.202; 17 27.235,7.107; 18 25.965,5.202; 19 24.695,7.107; 20 23.425,5.202; 21 22.155,7.107; 22 20.885,5.202; 23 19.615,7.107; 24 18.345,5.202; 25 17.075,7.107; 26 15.805,5.202; 27 14.535,7.107; 28 13.265,5.202; 29 11.995,7.107; 30 10.725,5.202; 31 9.455,7.107; 32 8.185,5.202; 33 6.915,7.107; 34 5.645,5.202; 35 47.555,3.297; 36 46.285,1.393; 37 45.015,3.297; 38 43.745,1.393; 39 42.475,3.297; 40 41.205,1.393; 41 39.935,3.297; 42 38.665,1.393; 43 37.395,3.297; 44 36.125,1.393; 45 34.855,3.297; 46 33.585,1.393; 47 32.315,3.297; 48 31.045,1.393; 49 29.775,3.297; 50 28.505,1.393; 51 27.235,3.297; 52 25.965,1.393; 53 24.695,3.297; 54 23.425,1.393; 55 22.155,3.297; 56 20.885,1.393; 57 19.615,3.297; 58 18.345,1.393; 59 17.075,3.297; 60 15.805,1.393; 61 14.535,3.297; 62 13.265,1.393; 63 11.995,3.297; 64 10.725,1.393; 65 9.455,3.297; 66 8.185,1.393; 67 6.915,3.297; 68 5.645,1.393
STELLARISLAUNCHPAD_CONNECTED = drill 1: P1 36.83,54.61; P2 39.37,54.61; P3 41.91,54.61; P4 44.45,54.61; P5 46.99,54.61; P6 49.53,54.61; P7 52.07,54.61; P8 54.61,54.61; P9 57.15,54.61; P10 59.69,54.61; P11 36.83,52.07; P12 39.37,52.07; P13 41.91,52.07; P14 44.45,52.07; P15 46.99,52.07; P16 49.53,52.07; P17 52.07,52.07; P18 54.61,52.07; P19 57.15,52.07; P20 59.69,52.07; P21 100.33,54.61; P22 102.87,54.61; P23 105.41,54.61; P24 107.95,54.61; P25 110.49,54.61; P26 113.03,54.61; P27 115.57,54.61; P28 118.11,54.61; P29 120.65,54.61; P30 123.19,54.61; P31 100.33,52.07; P32 102.87,52.07; P33 105.41,52.07; P34 107.95,52.07; P35 110.49,52.07; P36 113.03,52.07; P37 115.57,52.07; P38 118.11,52.07; P39 120.65,52.07; P40 123.19,52.07; P41 36.83,11.43; P42 39.37,11.43; P43 41.91,11.43; P44 44.45,11.43; P45 46.99,11.43; P46 49.53,11.43; P47 52.07,11.43; P48 54.61,11.43; P49 57.15,11.43; P50 59.69,11.43; P51 36.83,8.89; P52 39.37,8.89; P53 41.91,8.89; P54 44.45,8.89; P55 46.99,8.89; P56 49.53,8.89; P57 52.07,8.89; P58 54.61,8.89; P59 57.15,8.89; P60 59.69,8.89; P61 100.33,11.43; P62 102.87,11.43; P63 105.41,11.43; P64 107.95,11.43; P65 110.49,11.43; P66 113.03,11.43; P67 115.57,11.43; P68 118.11,11.43; P69 120.65,11.43; P70 123.19,11.43; P71 100.33,8.89; P72 102.87,8.89; P73 105.41,8.89; P74 107.95,8.89; P75 110.49,8.89; P76 113.03,8.89; P77 115.57,8.89; P78 118.11,8.89; P79 120.65,8.89; P80 123.19,8.89
691321100002 = drill 1.4: L -1.79,0; R 1.79,0
OKI-78SRH = drill 1.016: 1 2.54,0; 2 0,0; 3 -2.54,0

### Placement (x,y rotation side)
C1  83.66,11.91 90 top
C2  39.69,4.45 270 top
C3  37.47,4.45 270 top
C4  32.38,4.45 270 top
C5  34.61,4.45 270 top
C6  41.91,4.45 270 top
C7  100.17,37.31 90 top
C8  47.15,37.31 90 top
C9  7.14,66.83 90 top
C10  98.27,76.36 90 top
C11  47.15,52.86 270 top
C25  81.44,11.91 90 top
C26  85.88,11.91 90 top
C33  88.11,11.91 90 top
D1  94.61,4.45 180 top
JP1  81.28,4.6 0 top
R1  94.61,6.99 0 top
R2  50.01,37.31 270 top
R3  88.11,37.31 270 top
R4  52.86,37.31 90 top
R5  90.96,37.31 90 top
R6  56.36,37.31 270 top
R7  94.46,37.31 270 top
R8  59.21,37.31 90 top
R9  97.31,37.31 90 top
R10  62.71,37.31 270 top
R11  103.66,52.86 90 top
R12  65.56,37.31 90 top
R13  100.81,52.86 270 top
R14  69.06,37.31 270 top
R15  97.31,52.86 90 top
R16  71.91,37.31 90 top
R17  94.46,52.86 270 top
R18  75.41,37.31 270 top
R19  90.96,52.86 90 top
R20  78.26,37.31 90 top
R21  88.11,52.86 270 top
R22  81.76,37.31 270 top
R23  84.61,52.86 90 top
R24  84.61,37.31 90 top
R25  81.76,52.86 270 top
R26  78.26,52.86 90 top
R27  69.37,76.2 0 top
R28  75.41,52.86 270 top
R29  69.37,79.38 180 top
R30  71.91,52.86 90 top
R31  69.06,52.86 270 top
R32  65.56,52.86 90 top
R33  62.71,52.86 270 top
R34  59.21,52.86 90 top
R35  56.36,52.86 270 top
R36  52.86,52.86 90 top
R37  50.01,52.86 270 top
R38  77.47,87 180 top
R39  77.47,83.82 0 top
R40  7.78,13.34 270 top
RS-485-1  71.12,85.41 270 top
RS-485-2  76.99,77.63 90 top
RS_TRANS_1  51.44,29.84 0 top
RS_TRANS_2  89.53,29.84 0 top
RS_TRANS_3  57.78,29.84 0 top
RS_TRANS_4  95.89,29.84 0 top
RS_TRANS_5  64.14,29.84 0 top
RS_TRANS_6  102.23,60.48 180 top
RS_TRANS_7  70.48,29.84 0 top
RS_TRANS_8  95.89,60.48 180 top
RS_TRANS_9  76.83,29.84 0 top
RS_TRANS_10  89.53,60.48 180 top
RS_TRANS_11  83.19,29.84 0 top
RS_TRANS_12  83.19,60.48 180 top
RS_TRANS_13  76.83,60.48 180 top
RS_TRANS_14  70.48,60.48 180 top
RS_TRANS_15  64.14,60.48 180 top
RS_TRANS_16  57.78,60.48 180 top
RS_TRANS_17  51.44,60.48 180 top
S1  10.16,85.72 270 top
S2  10.16,4.45 270 top
S3  102.23,85.72 270 top
S4  102.23,4.45 270 top
U3_MUX  57.78,69.37 270 top
U4_MUX  74.3,69.37 90 top
U5_MUX  64.14,19.68 270 top
U6_MUX  92.08,69.37 90 top
U7_MUX  89.53,19.68 270 top
U$1  88.9,87 180 top
U$2  58.42,87 180 top
U$3  73.66,5.71 180 top
U$4  103.5,49.05 180 top
U$5  -6.99,125.25 270 top
U$6  H_WR-TBL_321*0002VERT  [691321100002]  54.61,3.17 0 top
U$7  H_WR-TBL_321*0002VERT  [691321100002]  64.77,3.17 0 top
U$8  29.21,5.71 90 top

### Tracks (layer width: path | path; a pad name or v marks a point on that pad's centre or on a via)
5V  (via drill 0.6)
  Top 0.61: C33.1 C26.1 C1.1 C25.1 | U$1.4 89.53,76.83 90.01,76.36 105.09,76.36 105.89,75.56 105.89,8.73 105.41,8.26 98.9,8.26 98.42,7.78 98.42,1.27 97.95,0.79 88.58,0.79 88.28,1.1 JP1.3 88.28,10.33 C33.1 | 88.14,10.48 C33.1 | v55.09,5.87 55.06,5.84 C6.1 C2.1 C3.1 35.05,8.26 U$8.1
  Bottom 0.61: U$1.5 U$1.4 | v55.09,5.87 56.99,5.87 61.28,1.59 87.33,1.59 88.28,2.54 JP1.3
18_RX+  (via drill 0.33 pad 0.69)
  Top 0.152: RS-485-2.A 73.66,76.2 R27.2 v70.48,76.2
  Bottom 0.152: v70.48,76.2 63.02,76.2 62.87,76.36 U$2.1
18_RX+1
  Top 0.152: RS-485-1.A 74.3,87 R38.2 | R38.2 76.07,87.02 | R38.2 76.07,88.14 76.2,88.27 80.64,88.27 80.8,88.11 80.8,82.87 80.96,82.71 93.19,82.71 93.34,82.55 U$1.1
18_RX-
  Top 0.152: RS-485-2.B 73.5,77.63 69.85,77.63 68.42,76.2 R27.1 61.75,76.2 61.59,76.36 U$2.2
18_RX-1
  Top 0.152: RS-485-1.B 74.3,85.72 77.47,85.72 78.74,87 R38.1 80.17,87 80.33,86.84 80.33,82.55 80.49,82.39 91.92,82.39 92.08,82.23 U$1.2
18_TX+
  Top 0.152: RS-485-2.Y 73.98,79.38 R29.1 70.77,80.52 70.64,80.64 64.93,80.64 64.77,80.8 64.77,81.76 64.61,81.92 60.48,81.92 60.33,81.76 U$2.3
18_TX+1
  Top 0.152: RS-485-1.Y 74.3,83.82 R39.1 76.07,81.09 76.2,80.96 83.66,80.96 83.82,80.8 83.82,79.53 83.98,79.38 90.65,79.38 90.81,79.53 U$1.3
18_TX-
  Top 0.152: RS-485-2.Z 73.82,77.95 69.85,77.95 68.42,79.38 R29.2 56.67,79.38 56.52,79.22 U$2.6
18_TX-1  (via drill 0.33 pad 0.69)
  Top 0.152: RS-485-1.Z 74.3,85.09 77.47,85.09 78.74,83.82 R39.2 78.87,81.78 79.06,81.6 v83.82,81.6
  Bottom 0.152: v83.82,81.6 83.82,79.53 83.98,79.38 86.84,79.38 87,79.22 U$1.6
+3V3
  pour Top: -3.81,94.77 -3.81,-2.38 110.49,-2.38 110.49,94.77
+12V
  Top 0.61: JP1.1 80.96,4.92 68.9,4.92 68.26,4.29 68.26,2.22 67.63,1.59 62.98,1.59 | 62.98,1.59 53.66,1.59 52.82,2.42 U$6.L | U$7.L 62.98,1.59
FAN_CONTROL_2
  Top 0.152: U$5.P65 R40.1
FAN_CTRL  (via drill 0.33)
  Top 0.152: R40.2 13.78,11.94 13.97,11.75 13.97,0.64 14.13,0.48 70.17,0.48 70.33,0.64 v70.33,3.65 | U$3.2 74.3,9.53 74.14,9.68 71.91,9.68 71.75,9.53 U$3.4 v71.75,7.62
  Bottom 0.152: v71.75,7.62 70.48,7.62 70.33,7.46 v70.33,3.65
GND  (via drill 0.33 pad 0.69)
  Top 0.152: U5_MUX.8 v59.69,21.91 | U5_MUX.7 v60.96,21.91 | U5_MUX.6 v62.23,21.91 | U7_MUX.6 v87.63,21.91 | U7_MUX.7 v86.36,21.91 | U7_MUX.8 v85.09,21.91 | RS_TRANS_11.GND v85.09,27.15 | RS_TRANS_6.GND v100.33,63.18 | RS_TRANS_4.GND v97.79,27.15 | RS_TRANS_2.GND v91.44,27.15 | RS_TRANS_9.GND v78.74,27.15 | RS_TRANS_5.GND v66.04,27.15 | RS_TRANS_3.GND v59.69,27.15 | RS_TRANS_1.GND v53.34,27.15 | RS_TRANS_7.GND v72.39,27.15 | C25.2 v81.44,13.02 | C1.2 v83.66,13.02 | C26.2 v85.88,13.02 | C33.2 v88.11,13.02 | U$3.8 v75.56,3.81 | v74.3,3.81 U$3.7 | U$3.6 v73.03,3.81 | D1.C 93.11,3.88 v93.34,4.45 | v53.34,71.6 U3_MUX.8 | RS_TRANS_17.GND v49.53,63.18 | v55.88,63.18 RS_TRANS_16.GND | RS_TRANS_15.GND v62.23,63.18 | v68.58,63.18 RS_TRANS_14.GND | RS_TRANS_13.GND v74.93,63.18 | v81.28,63.18 RS_TRANS_12.GND | RS_TRANS_10.GND v87.63,63.18 | v93.98,63.18 RS_TRANS_8.GND | RS-485-2.GND v79.69,79.53 | RS-485-1.GND v68.42,83.5 | U$3.5 v71.75,3.81 | U3_MUX.7 v54.61,71.6 | U3_MUX.6 v55.88,71.6 | U4_MUX.6 v76.2,67.15 | U4_MUX.7 v77.47,67.15 | U4_MUX.8 v78.74,67.15 | U6_MUX.7 v95.25,67.15 | U6_MUX.6 v93.98,67.15 | U6_MUX.8 v96.52,67.15 | C9.2 v7.14,67.79 | v98.27,77.31 C10.2 | C11.2 v47.15,51.91
  Top 0.406: C4.2 v32.38,3.49 | v34.61,3.49 C5.2 | C3.2 v37.47,3.49 | v39.69,3.49 C2.2 | C6.2 v41.91,3.49
  Top 0.61: C7.2 v100.17,38.26 | C8.2 v47.15,38.26
  other vias: 71.75,3.17 73.03,3.17 74.3,3.17 75.56,3.17
  pour Bottom: -2.54,93.5 -2.54,-1.75 108.58,-1.75 108.58,93.5
JACK_1_RX+
  Top 0.152: RS_TRANS_17.A 53.34,54.74 R36.2 54.16,54.26 54.29,54.13 54.29,49.05 54.45,48.9 59.53,48.9 59.76,48.67 U$4.38
JACK_1_RX-
  Top 0.152: RS_TRANS_17.B 51.59,57.15 51.59,52.7 52.84,51.46 R36.1 52.86,48.74 53.02,48.58 58.26,48.58 58.49,48.35 U$4.37
JACK_1_TX+
  Top 0.152: RS_TRANS_17.Y 49.53,54.74 R37.1 51.15,54.26 51.28,54.13 51.28,47.78 51.4,47.66 U$4.36
JACK_1_TX-
  Top 0.152: RS_TRANS_17.Z 50.8,58.42 50.64,58.58 48.9,58.58 48.74,58.42 48.74,51.59 48.87,51.46 R37.2 50.01,47.47 50.16,47.31 55.72,47.31 55.95,47.08 U$4.35
JACK_2_RX+
  Top 0.152: RS_TRANS_16.A 59.69,54.74 R34.2 60.48,52.99 60.48,50.8 60.8,50.48 61.28,50.48 61.75,50.01 61.75,49.21 62.07,48.9 64.61,48.9 64.84,48.67 U$4.42
JACK_2_RX-
  Top 0.152: RS_TRANS_16.B 57.94,57.15 57.94,52.7 59.19,51.46 R34.1 59.21,50.32 59.53,50.01 61.12,50.01 61.44,49.69 61.44,48.9 61.75,48.58 63.34,48.58 63.57,48.35 U$4.41
JACK_2_TX+
  Top 0.152: RS_TRANS_16.Y 55.88,54.74 R35.1 57.34,54.26 57.63,53.98 57.63,50.32 57.78,50.16 58.74,50.16 58.9,50.01 58.9,49.69 59.05,49.53 60.96,49.53 61.12,49.37 61.12,47.78 61.24,47.66 U$4.40
JACK_2_TX-
  Top 0.152: 56.33,51.44 R35.2 | R35.2 55.22,51.46 55.09,51.59 55.09,58.42 55.24,58.58 56.99,58.58 57.15,58.42 RS_TRANS_16.Z | U$4.39 61.03,47.4 60.8,47.62 60.8,49.05 60.64,49.21 56.52,49.21 56.36,49.37 R35.2
JACK_3_RX+
  Top 0.152: RS_TRANS_15.A 66.04,54.74 R32.2 65.69,54.13 66.67,54.13 66.83,53.98 66.83,50.48 67.15,50.16 69.69,50.16 69.92,49.94 U$4.46
JACK_3_RX-
  Top 0.152: RS_TRANS_15.B 64.29,57.15 64.29,52.7 65.53,51.46 R32.1 65.56,50.16 65.88,49.85 68.26,49.85 68.65,49.46 U$4.45
JACK_3_TX+
  Top 0.152: RS_TRANS_15.Y 62.23,54.74 R33.1 63.98,52.99 63.98,49.85 64.29,49.53 66.99,49.53 67.38,49.14 U$4.44
JACK_3_TX-
  Top 0.152: RS_TRANS_15.Z 63.5,58.42 63.34,58.58 61.59,58.58 61.44,58.42 61.44,51.59 61.57,51.46 R33.2 62.71,49.53 63.02,49.21 65.88,49.21 66.11,48.98 U$4.43
JACK_4_RX+
  Top 0.152: RS_TRANS_14.A 72.39,54.74 R30.2 72.04,54.13 73.03,54.13 73.18,53.98 73.18,50.16 73.5,49.85 74.77,49.85 75,49.62 U$4.50
JACK_4_RX-
  Top 0.152: U$4.49 73.73,49.3 73.5,49.53 72.23,49.53 71.91,49.85 R30.1 71.25,51.46 70.64,52.07 70.64,57.15 RS_TRANS_14.B
JACK_4_TX+
  Top 0.152: RS_TRANS_14.Y 68.58,54.74 R31.1 69.08,54.29 70.01,54.29 70.33,53.98 70.33,51.75 70.64,51.44 70.64,49.37 70.8,49.21 72.23,49.21 72.46,48.98 U$4.48
JACK_4_TX-
  Top 0.152: U$4.47 71.19,48.67 70.96,48.9 70.64,48.9 70.33,49.21 70.33,51.28 70.17,51.44 69.08,51.44 R31.2 68.08,51.46 67.79,51.75 67.79,58.42 67.94,58.58 69.69,58.58 69.85,58.42 RS_TRANS_14.Z
JACK_5_RX+
  Top 0.152: RS_TRANS_13.A 78.74,54.74 R26.2 78.39,54.13 79.38,54.13 79.69,53.82 79.69,48.74 80.08,48.35 U$4.54
JACK_5_RX-
  Top 0.152: U$4.53 78.81,50.92 R26.1 77.44,51.46 76.99,51.91 76.99,57.15 RS_TRANS_13.B
JACK_5_TX+
  Top 0.152: RS_TRANS_13.Y 74.93,54.74 R28.1 75.44,54.29 76.36,54.29 76.68,53.98 76.68,48.9 76.83,48.74 77.31,48.74 77.54,48.51 U$4.52
JACK_5_TX-
  Top 0.152: R28.2 75.88,50.99 | U$4.51 76.27,48.35 76.04,48.58 75.56,48.58 75.41,48.74 R28.2 | R28.2 74.27,51.46 74.14,51.59 74.14,58.26 74.45,58.58 76.04,58.58 76.2,58.42 RS_TRANS_13.Z
JACK_6_RX+
  Top 0.152: RS_TRANS_12.A 85.09,54.74 R23.2 84.9,53.98 85.72,53.98 86.04,53.66 86.04,50.16 85.88,50.01 85.41,50.01 85.16,49.76 U$4.58
JACK_6_RX-
  Top 0.152: U$4.57 83.89,50.74 R23.1 83.47,51.46 83.34,51.59 83.34,57.15 RS_TRANS_12.B
JACK_6_TX+
  Top 0.152: RS_TRANS_12.Y 81.28,54.74 R25.1 81.89,54.13 82.87,54.13 83.03,53.98 83.03,50.32 82.62,49.92 U$4.56
JACK_6_TX-
  Top 0.152: U$4.55 81.35,51.06 R25.2 80.78,51.46 80.49,51.75 80.49,58.26 80.8,58.58 82.39,58.58 82.55,58.42 RS_TRANS_12.Z
JACK_7_RX+
  Top 0.152: RS_TRANS_10.A 91.44,54.74 R19.2 90.99,54.29 92.08,54.29 92.23,54.13 92.23,49.53 91.92,49.21 90.49,49.21 90.24,48.97 U$4.62
JACK_7_RX-
  Top 0.152: U$4.61 88.97,49.44 89.22,49.69 90.65,49.69 90.96,50.01 R19.1 89.82,51.46 89.69,51.59 89.69,57.15 RS_TRANS_10.B
JACK_7_TX+
  Top 0.152: RS_TRANS_10.Y 87.63,54.74 R21.1 88.14,54.29 89.22,54.29 89.38,54.13 89.38,50.32 89.22,50.16 87.95,50.16 87.7,49.92 U$4.60
JACK_7_TX-
  Top 0.152: U$4.59 86.43,51.19 86.71,51.46 86.97,51.46 | 88.08,51.44 R21.2 86.97,51.46 | 86.97,51.46 86.84,51.59 86.84,58.26 87.15,58.58 88.58,58.58 88.9,58.26 RS_TRANS_10.Z
JACK_8_RX+
  Top 0.152: RS_TRANS_8.A 97.79,54.74 R15.2 97.5,54.45 98.42,54.45 98.58,54.29 98.58,49.53 98.42,49.37 95.57,49.37 95.32,49.12 U$4.66
JACK_8_RX-
  Top 0.152: U$4.65 94.05,49.44 94.3,49.69 97.16,49.69 97.31,49.85 R15.1 96.33,51.46 96.04,51.75 96.04,57.15 RS_TRANS_8.B
JACK_8_TX+
  Top 0.152: RS_TRANS_8.Y 93.98,54.74 R17.1 94.59,54.13 95.57,54.13 95.73,53.98 95.73,50.32 95.57,50.16 93.5,50.16 93.34,50.01 93.34,47.94 93.06,47.66 U$4.64
JACK_8_TX-
  Top 0.152: U$4.63 91.51,48.49 91.76,48.74 92.39,48.74 92.55,48.9 92.55,51.12 92.87,51.44 94.43,51.44 R17.2 93.79,51.46 93.19,52.07 93.19,58.42 93.34,58.58 95.09,58.58 95.25,58.42 RS_TRANS_8.Z
JACK_9_RX+
  Top 0.152: RS_TRANS_6.A 104.14,54.74 R11.2 103.69,54.29 104.78,54.29 104.93,54.13 104.93,42.23 104.65,41.95 U$4.33
JACK_9_RX-
  Top 0.152: R11.1 103.66,51.75 102.39,53.02 102.39,57.15 RS_TRANS_6.B | R11.1 103.69,51.46 | U$4.34 103.38,43.85 103.66,44.13 R11.1
JACK_9_TX+
  Top 0.152: RS_TRANS_6.Y 100.33,54.74 R13.1 100.83,54.29 101.76,54.29 102.08,53.98 102.08,49.05 101.6,48.58 98.11,48.58 97.86,48.33 U$4.68
JACK_9_TX-
  Top 0.152: U$4.67 96.59,48.81 96.84,49.05 100.49,49.05 100.81,49.37 R13.2 99.83,51.46 99.54,51.75 99.54,58.42 99.69,58.58 101.44,58.58 101.6,58.42 RS_TRANS_6.Z
JACK_10_RX+
  Top 0.152: RS_TRANS_4.A 93.98,35.43 R7.2 93.47,35.91 93.19,36.2 93.19,41.12 92.36,41.95 U$4.29
JACK_10_RX-
  Top 0.152: RS_TRANS_4.B 95.73,33.18 95.73,37.15 94.46,38.42 R7.1 93.53,38.71 93.53,41.25 92.78,42 U$4.30
JACK_10_TX+
  Top 0.152: RS_TRANS_4.Y 97.79,35.43 R9.1 96.33,35.91 96.04,36.2 96.04,39.85 95.89,40.01 94.3,40.01 94.05,40.25 U$4.31
JACK_10_TX-
  Top 0.152: RS_TRANS_4.Z 96.52,31.91 96.68,31.75 98.42,31.75 98.58,31.91 98.58,38.58 98.42,38.73 97.34,38.73 R9.2 97.31,40.01 97,40.32 95.57,40.32 95.32,40.57 U$4.32
JACK_11_RX+
  Top 0.152: RS_TRANS_2.A 87.63,35.43 R3.2 | R3.2 88.08,35.91 | R3.2 86.97,35.91 86.43,36.44 U$4.25
JACK_11_RX-
  Top 0.152: R3.1 88.14,38.71 88.27,38.58 88.27,38.26 89.38,37.15 89.38,33.18 RS_TRANS_2.B | R3.1 88.11,38.89 | U$4.26 87.7,39.11 R3.1
JACK_11_TX+
  Top 0.152: RS_TRANS_2.Y 91.44,35.43 R5.1 89.98,35.91 89.69,36.2 89.69,41.22 U$4.27
JACK_11_TX-
  Top 0.152: RS_TRANS_2.Z 90.17,31.91 90.33,31.75 92.08,31.75 92.23,31.91 92.23,38.42 91.94,38.71 R5.2 90.96,40.01 90.24,40.73 U$4.28
JACK_12_RX+
  Top 0.152: RS_TRANS_11.A 81.28,35.43 R22.2 80.78,35.91 80.49,36.2 80.49,41.75 80.68,41.95 U$4.21
JACK_12_RX-
  Top 0.152: RS_TRANS_11.B 83.03,33.18 83.03,37.15 81.76,38.42 R22.1 82.62,39.57 U$4.22
JACK_12_TX+
  Top 0.152: RS_TRANS_11.Y 85.09,35.43 R24.1 83.63,35.91 83.34,36.2 83.34,41.4 U$4.23
JACK_12_TX-
  Top 0.152: R24.2 84.33,38.71 | RS_TRANS_11.Z 83.82,31.91 83.98,31.75 85.72,31.75 85.88,31.91 85.88,38.42 85.59,38.71 R24.2 | U$4.24 85.16,39.25 R24.2
JACK_13_RX+
  Top 0.152: RS_TRANS_9.A 74.93,35.43 R18.2 74.42,35.91 74.14,36.2 74.14,40.48 74.45,40.8 76.04,40.8 76.27,41.03 U$4.17
JACK_13_RX-
  Top 0.152: RS_TRANS_9.B 76.68,33.18 76.68,37.15 75.41,38.42 R18.1 75.41,40.16 75.72,40.48 77.15,40.48 77.54,40.87 U$4.18
JACK_13_TX+
  Top 0.152: RS_TRANS_9.Y 78.74,35.43 R20.1 77.28,35.91 76.99,36.2 76.99,39.69 77.31,40.01 77.63,40.01 77.95,40.32 77.95,41.75 78.14,41.95 U$4.19
JACK_13_TX-
  Top 0.152: R20.2 78.13,38.71 | RS_TRANS_9.Z 77.47,31.91 77.63,31.75 79.38,31.75 79.53,31.91 79.53,38.42 79.25,38.71 R20.2 | R20.2 78.26,40.64 78.42,40.8 79.85,40.8 80.08,41.03 U$4.20
JACK_14_RX+
  Top 0.152: RS_TRANS_7.A 68.58,35.43 R14.2 70.04,35.91 70.33,36.2 70.33,41.75 70.52,41.95 U$4.13
JACK_14_RX-
  Top 0.152: U$4.14 72.46,43.09 72.23,42.86 70.33,42.86 70.01,42.55 70.01,41.43 69.85,41.27 69.22,41.27 69.06,41.12 R14.1 68.08,38.71 67.79,38.42 67.79,31.91 67.94,31.75 69.69,31.75 69.85,31.91 RS_TRANS_7.B
JACK_14_TX+
  Top 0.152: RS_TRANS_7.Y 72.39,35.43 R16.1 72.89,35.91 73.25,36.27 73.25,41.47 U$4.15
JACK_14_TX-
  Top 0.152: RS_TRANS_7.Z 70.64,33.18 70.64,37.15 71.91,38.42 R16.2 72.07,38.87 72.07,42.23 72.39,42.55 73.03,42.55 73.34,42.86 73.34,43.5 73.7,43.85 U$4.16
JACK_15_RX+
  Top 0.152: RS_TRANS_5.A 62.23,35.43 R10.2 63.69,35.91 63.98,36.2 63.98,39.69 64.29,40.01 65.72,40.01 66.11,40.39 U$4.9
JACK_15_RX-
  Top 0.152: RS_TRANS_5.B 63.5,31.91 63.34,31.75 61.59,31.75 61.44,31.91 61.44,38.42 61.73,38.71 R10.1 62.71,40.16 62.87,40.32 64.61,40.32 64.77,40.48 64.77,42.55 65.09,42.86 67.15,42.86 67.38,43.09 U$4.10
JACK_15_TX+
  Top 0.152: RS_TRANS_5.Y 66.04,35.43 R12.1 66.55,35.91 66.83,36.2 66.83,39.37 66.99,39.53 67.47,39.53 67.63,39.69 67.63,41.75 67.82,41.95 U$4.11
JACK_15_TX-
  Top 0.152: RS_TRANS_5.Z 64.29,33.18 64.29,37.15 65.56,38.42 R12.2 65.72,38.87 65.72,39.53 66.04,39.85 67.15,39.85 67.31,40.01 67.31,42.55 67.63,42.86 69.69,42.86 69.92,43.09 U$4.12
JACK_16_RX+
  Top 0.152: RS_TRANS_3.A 55.88,35.43 R6.2 57.34,35.91 57.63,36.2 57.63,39.69 57.94,40.01 59.69,40.01 60.01,40.32 60.01,41.75 60.2,41.95 U$4.5
JACK_16_RX-
  Top 0.152: U$4.6 62.3,43.09 62.07,42.86 60.01,42.86 59.69,42.55 59.69,40.64 59.37,40.32 56.67,40.32 56.36,40.01 R6.1 55.38,38.71 55.09,38.42 55.09,31.91 55.24,31.75 56.99,31.75 57.15,31.91 RS_TRANS_3.B
JACK_16_TX+
  Top 0.152: RS_TRANS_3.Y 59.69,35.43 | 59.69,35.43 R8.1 60.35,35.91 60.64,36.2 60.64,40.48 60.8,40.64 63.34,40.64 63.57,40.87 U$4.7 | 59.69,35.43 59.72,35.43
JACK_16_TX-
  Top 0.152: RS_TRANS_3.Z 57.94,33.18 57.94,37.15 59.21,38.42 R8.2 59.21,39.37 59.53,39.69 60.01,39.69 60.33,40.01 60.33,40.8 60.48,40.96 61.59,40.96 61.91,41.27 61.91,42.23 62.55,42.86 64.61,42.86 64.84,43.09 U$4.8
JACK_17_RX+
  Top 0.152: RS_TRANS_1.A 49.53,35.43 R2.2 50.99,35.91 51.28,36.2 51.28,41.59 51.63,41.95 U$4.1
JACK_17_RX-
  Top 0.152: U$4.2 50.68,43.85 50.01,43.18 R2.1 48.92,38.71 48.9,38.73 48.74,38.58 48.74,31.91 48.9,31.75 50.64,31.75 50.8,31.91 RS_TRANS_1.B
JACK_17_TX+
  Top 0.152: RS_TRANS_1.Y 53.34,35.43 R4.1 54,35.91 54.29,36.2 54.29,40.32 54.61,40.64 58.1,40.64 58.49,41.03 U$4.3
JACK_17_TX-
  Top 0.152: RS_TRANS_1.Z 51.59,33.18 51.59,37.15 52.86,38.42 R4.2 52.86,40.64 53.18,40.96 56.52,40.96 56.83,41.27 56.83,42.55 57.15,42.86 59.37,42.86 59.76,43.25 U$4.4
N$45
  Top 0.152: 96.11,6.88 R1.2
  Top 0.61: 96.11,6.88 D1.A
OUT_1
  Top 0.61: U$7.R 66.56,4.96 67.31,5.71 74.93,5.71 75.56,6.35 U$3.1
OUT_2
  Top 0.61: U$6.R 56.4,5.76 57.15,6.51 72.39,6.51 73.03,7.14 U$3.3
U2_SENSOR_RX  (via drill 0.33)
  Top 0.152: RS-485-1.RO 68.9,86.04 69.22,85.72 69.22,84.3 69.06,84.14 67.47,84.14 67.31,83.98 67.31,83.03 67.15,82.87 50.48,82.87 v50.16,83.19 | v50.16,75.72 v50.16,68.42 | v50.16,25.08 50.16,21.11 50.01,20.95 45.24,20.95 45.09,20.8 U$5.P33
  Bottom 0.152: v50.16,83.19 v50.16,75.72 | v50.16,68.42 v50.16,25.08
U2_SENSOR_TX
  Top 0.152: RS-485-1.DI 68.42,84.77 68.42,84.61 RS-485-1.DI | U$5.P57 2.86,73.18 3.02,73.34 3.02,84.61 3.17,84.77 6.03,84.77 6.19,84.61 6.19,81.6 6.35,81.44 43.81,81.44 43.97,81.6 43.97,84.3 44.13,84.45 50.64,84.45 50.8,84.3 50.8,83.34 50.96,83.19 66.83,83.19 66.99,83.34 66.99,84.61 67.15,84.77 RS-485-1.DI
U3_JACK_1_RX
  Top 0.152: RS_TRANS_15.RO 64.77,62.07 64.61,61.91 56.67,61.91 56.52,62.07 56.52,64.93 56.67,65.09 59.53,65.09 59.69,65.25 U3_MUX.14
U3_JACK_1_TX  (via drill 0.33, 0.33 pad 0.69)
  Top 0.152: v57.15,71.6 U3_MUX.5 | v61.59,70.01 63.34,70.01 63.5,69.85 RS_TRANS_15.DI
  Bottom 0.152: v57.15,71.6 61.44,71.6 61.59,71.44 v61.59,70.01
U3_JACK_2_RX
  Top 0.152: RS_TRANS_16.RO 58.42,64.14 58.58,64.29 60.8,64.29 60.96,64.45 U3_MUX.15
U3_JACK_2_TX
  Top 0.152: RS_TRANS_16.DI 57.15,64.45 57.31,64.61 60.17,64.61 60.33,64.77 60.33,71.44 60.48,71.6 60.91,71.6 U3_MUX.2
U3_JACK_3_RX
  Top 0.152: RS_TRANS_17.RO 52.07,64.14 52.23,64.29 55.72,64.29 55.88,64.45 U3_MUX.11
U3_JACK_3_TX
  Top 0.152: RS_TRANS_17.DI 50.8,64.45 50.96,64.61 55.09,64.61 55.24,64.77 55.24,67.79 55.4,67.94 58.26,67.94 58.42,68.1 U3_MUX.4
U3_MUX_S0
  Top 0.152: U$5.P44 5.4,80.8 5.56,80.64 5.56,66.83 5.71,66.67 52.55,66.67 52.7,66.52 52.7,65.72 52.86,65.56 54.45,65.56 54.61,65.72 U3_MUX.10
U3_MUX_S1
  Top 0.152: U$5.P43 5.71,83.34 5.87,83.19 5.87,67.15 6.03,66.99 53.02,66.99 53.23,66.78 U3_MUX.9
U3RX  (via drill 0.33)
  Top 0.152: U3_MUX.13 58.84,66.78 59.05,66.99 59.05,76.36 58.9,76.52 51.59,76.52 51.44,76.68 v51.44,81.6
  Bottom 0.152: U$5.P12 45.09,86.84 45.24,87 50.16,87 50.32,86.84 50.32,84.93 50.48,84.77 51.28,84.77 51.44,84.61 v51.44,81.6
U3TX  (via drill 0.33)
  Top 0.152: v52.07,80.96 52.07,76.99 52.23,76.83 59.53,76.83 59.69,76.68 U3_MUX.3
  Bottom 0.152: U$5.P11 45.09,87.47 45.24,87.31 50.48,87.31 50.64,87.15 50.64,85.25 50.8,85.09 51.91,85.09 52.07,84.93 v52.07,80.96
U4_JACK_12_RX
  Top 0.152: RS_TRANS_13.RO 76.99,63.34 76.83,63.5 76.83,70.64 76.68,70.8 72.55,70.8 72.39,70.96 U4_MUX.14
U4_JACK_12_TX
  Top 0.152: RS_TRANS_13.DI 76.2,64.14 76.04,64.29 75.09,64.29 74.93,64.45 U4_MUX.5
U4_JACK_13_RX
  Top 0.152: RS_TRANS_14.RO 71.12,65.09 71.28,65.25 71.6,65.25 71.75,65.41 71.75,70.01 71.6,70.17 71.28,70.17 71.12,70.33 U4_MUX.15 71.17,71.91
U4_JACK_13_TX
  Top 0.152: RS_TRANS_14.DI 69.85,65.41 70.01,65.56 70.96,65.56 71.12,65.72 U4_MUX.2
U4_MUX_S0  (via drill 0.33)
  Top 0.152: 77.47,71.44 v77.47,71.6 U4_MUX.10 | v77.47,89.38 77.15,89.69 2.06,89.69 1.91,89.53 U$5.P51
  Bottom 0.152: v77.47,89.38 v77.47,71.6
U4_MUX_S1  (via drill 0.33)
  Top 0.152: U4_MUX.9 v78.74,71.6 | U$5.P59 2.86,68.1 3.02,67.94 3.02,61.75 3.17,61.59 v50.8,61.59 | v55.88,61.59 v76.83,61.59
  Bottom 0.152: v78.74,71.6 78.74,69.06 78.58,68.9 76.99,68.9 76.83,68.74 v76.83,61.59 | v50.8,61.59 v55.88,61.59
U4_POWERBOARD_TX
  Top 0.152: RS-485-2.DI 76.04,78.26 75.88,78.11 75.88,73.34 75.72,73.18 71.91,73.18 71.75,73.03 71.75,70.64 71.91,70.48 73.5,70.48 73.66,70.33 U4_MUX.4
U4_POWRBOARD_RX
  Top 0.152: RS-485-2.RO 76.36,76.99 76.2,76.83 U4_MUX.11
U4RX  (via drill 0.33)
  Top 0.152: U4_MUX.13 v73.66,71.6 | U$5.P16 45.09,76.68 45.24,76.83 50.64,76.83 50.8,76.68 50.8,76.04 50.96,75.88 57.47,75.88 57.63,75.72 v57.63,74.45
  Bottom 0.152: v73.66,71.6 73.66,74.3 73.5,74.45 v57.63,74.45
U4TX  (via drill 0.33)
  Top 0.152: U4_MUX.3 v72.39,67.15 | v70.48,68.58 70.48,70.64 70.33,70.8 67.47,70.8 67.31,70.96 67.31,74.77 66.99,75.09 v60.96,75.09 | v58.42,75.09 58.42,76.04 58.26,76.2 51.28,76.2 51.12,76.36 51.12,76.99 50.96,77.15 45.24,77.15 45.09,77.31 U$5.P15
  Bottom 0.152: v72.39,67.15 72.39,68.42 72.23,68.58 v70.48,68.58 | v60.96,75.09 v58.42,75.09
U5_JACK_4_RX
  Top 0.152: U5_MUX.12 63.5,18.1 63.66,18.26 66.52,18.26 66.67,18.1 66.67,16.03 66.83,15.88 69.69,15.88 69.85,16.03 69.85,24.92 70.01,25.08 72.87,25.08 73.03,25.24 73.03,27.78 72.87,27.94 70.01,27.94 69.85,27.78 RS_TRANS_7.RO
U5_JACK_4_TX
  Top 0.152: RS_TRANS_7.DI 71.12,25.56 70.96,25.4 68.74,25.4 68.58,25.24 U5_MUX.1
U5_JACK_5_RX
  Top 0.152: RS_TRANS_1.RO 50.8,25.88 50.96,25.72 56.2,25.72 56.36,25.56 56.36,24.29 56.52,24.13 58.74,24.13 58.9,23.97 58.9,21.43 59.21,21.11 61.44,21.11 61.59,20.95 61.59,16.03 61.75,15.88 65.88,15.88 66.04,16.03 U5_MUX.14
U5_JACK_5_TX
  Top 0.152: RS_TRANS_1.DI 52.07,26.19 52.23,26.04 56.52,26.04 56.67,25.88 56.67,24.61 56.83,24.45 63.34,24.45 63.5,24.29 U5_MUX.5
U5_JACK_6_RX
  Top 0.152: RS_TRANS_5.RO 63.5,25.72 63.66,25.56 66.52,25.56 66.67,25.4 66.67,18.73 66.83,18.57 67.15,18.57 67.31,18.41 U5_MUX.15 67.26,17.14
U5_JACK_6_TX
  Top 0.152: RS_TRANS_5.DI 64.77,26.19 64.93,26.04 67.15,26.04 67.31,25.88 U5_MUX.2
U5_JACK_7_RX
  Top 0.152: RS_TRANS_3.RO 57.15,25.08 57.31,24.92 63.98,24.92 64.14,24.77 64.14,21.27 63.98,21.11 62.39,21.11 62.23,20.95 U5_MUX.11
U5_JACK_7_TX
  Top 0.152: RS_TRANS_3.DI 58.42,25.56 58.74,25.24 64.61,25.24 64.77,25.08 U5_MUX.4
U5_MUX_S0
  Top 0.152: U5_MUX.10 60.96,16.03 60.8,15.88 5.87,15.88 5.71,16.03 5.71,17.14 5.56,17.3 U$5.P64
U5_MUX_S1
  Top 0.152: U5_MUX.9 59.69,16.51 59.37,16.19 6.19,16.19 6.03,16.35 6.03,19.68 5.87,19.84 U$5.P63
U5RX  (via drill 0.33 pad 0.69)
  Top 0.152: U5_MUX.13 v64.77,17.46
  Bottom 0.152: v64.77,17.46 64.77,16.03 64.61,15.88 48.9,15.88 48.74,15.72 48.74,12.38 48.58,12.22 U$5.P26
U5TX  (via drill 0.33)
  Top 0.152: U5_MUX.3 66.04,20 65.88,19.84 v62.87,19.84 | v60.96,19.84 U$5.P23
  Bottom 0.152: v62.87,19.84 v60.96,19.84
U6_JACK_14_RX
  Top 0.152: RS_TRANS_6.RO 102.87,69.69 102.71,69.85 92.87,69.85 92.71,70.01 U6_MUX.12
U6_JACK_14_TX  (via drill 0.33, 0.33 pad 0.69)
  Top 0.152: v87.63,67.15 U6_MUX.1 | v93.98,68.58 101.44,68.58 101.6,68.42 RS_TRANS_6.DI
  Bottom 0.152: v87.63,67.15 87.63,67.79 87.79,67.94 93.82,67.94 93.98,68.1 v93.98,68.58
U6_JACK_15_RX
  Top 0.152: RS_TRANS_8.RO 96.52,62.55 96.36,62.39 92.23,62.39 92.08,62.55 92.08,64.29 91.92,64.45 90.96,64.45 90.81,64.61 90.81,71.75 90.65,71.91 90.22,71.91 U6_MUX.14
U6_JACK_15_TX
  Top 0.152: RS_TRANS_8.DI 95.25,64.14 95.09,64.29 92.87,64.29 92.71,64.45 U6_MUX.5
U6_JACK_16_RX
  Top 0.152: RS_TRANS_10.RO 89.69,63.34 89.53,63.5 89.53,71.75 89.38,71.91 88.95,71.91 U6_MUX.15
U6_JACK_16_TX
  Top 0.152: RS_TRANS_10.DI U6_MUX.2
U6_JACK_17_RX
  Top 0.152: RS_TRANS_12.RO 83.82,64.14 83.98,64.29 88.11,64.29 88.27,64.45 88.27,73.03 88.42,73.18 93.82,73.18 93.98,73.03 U6_MUX.11
U6_JACK_17_TX  (via drill 0.33, 0.33 pad 0.69)
  Top 0.152: v91.44,67.15 U6_MUX.4 | v86.36,67.15 86.36,64.77 86.2,64.61 82.71,64.61 82.55,64.45 RS_TRANS_12.DI
  Bottom 0.152: v86.36,67.15 86.36,66.52 86.52,66.36 91.28,66.36 91.44,66.52 v91.44,67.15
U6_MUX_S0
  Top 0.152: U6_MUX.10 95.25,74.93 95.09,75.09 82.39,75.09 82.23,75.25 82.23,80.17 82.07,80.33 75.41,80.33 75.25,80.49 75.25,82.07 75.09,82.23 49.53,82.23 49.21,81.92 45.24,81.92 45.09,81.76 U$5.P14
U6_MUX_S1
  Top 0.152: U6_MUX.9 96.52,75.25 96.36,75.41 82.71,75.41 82.55,75.56 82.55,80.49 82.39,80.64 75.72,80.64 75.56,80.8 75.56,82.39 75.41,82.55 49.21,82.55 48.9,82.23 45.24,82.23 45.09,82.39 U$5.P13
U6RX  (via drill 0.33)
  Top 0.152: U6_MUX.13 v91.44,69.53 | v77.47,69.53 87.47,69.53 v87.63,69.37
  Bottom 0.152: v91.44,69.53 87.79,69.53 v87.63,69.37 | v77.47,69.53 70.01,69.53 69.85,69.37 69.85,69.22 69.69,69.06 49.05,69.06 48.9,69.22 48.9,70.48 48.74,70.64 U$5.P8
U6TX  (via drill 0.33)
  Top 0.152: U6_MUX.3 v90.17,70.17 | v78.11,70.17 87.47,70.17 v87.63,70.33
  Bottom 0.152: v90.17,70.17 87.79,70.17 v87.63,70.33 | U$5.P7 49.05,73.18 49.21,73.03 49.21,69.53 49.37,69.37 69.37,69.37 69.53,69.53 69.53,70.01 69.69,70.17 v78.11,70.17
U7_JACK_8_RX
  Top 0.152: RS_TRANS_11.RO 82.55,24.45 82.71,24.29 88.11,24.29 88.27,24.13 88.27,17.3 88.42,17.14 88.85,17.14 U7_MUX.12
U7_JACK_8_TX  (via drill 0.33)
  Top 0.152: v88.27,24.92 84.14,24.92 83.82,25.24 RS_TRANS_11.DI | U7_MUX.1 93.98,24.77 93.82,24.92 v93.34,24.92
  Bottom 0.152: v93.34,24.92 v88.27,24.92
U7_JACK_9_RX
  Top 0.152: RS_TRANS_2.RO 89.38,26.99 89.53,26.83 89.53,21.27 89.69,21.11 91.28,21.11 91.44,20.95 U7_MUX.14
U7_JACK_9_TX
  Top 0.152: U7_MUX.5 88.9,25.72 88.74,25.88 88.58,25.88 88.42,26.04 88.42,27.78 88.58,27.94 90.01,27.94 90.17,27.78 RS_TRANS_2.DI
U7_JACK_10_RX
  Top 0.152: RS_TRANS_4.RO 95.25,21.27 95.09,21.11 92.87,21.11 92.71,20.95 U7_MUX.15
U7_JACK_10_TX
  Top 0.152: RS_TRANS_4.DI 96.52,28.57 96.36,28.73 93.19,28.73 93.03,28.57 93.03,25.88 92.71,25.56 U7_MUX.2
U7_JACK_11_RX
  Top 0.152: RS_TRANS_9.RO 76.2,25.72 76.36,25.56 81.92,25.56 82.07,25.4 82.07,24.13 82.23,23.97 86.84,23.97 87,23.81 87,17.3 87.15,17.14 87.58,17.14 U7_MUX.11
U7_JACK_11_TX
  Top 0.152: RS_TRANS_9.DI 77.47,28.57 77.63,28.73 92.08,28.73 92.23,28.57 92.23,26.19 92.08,26.04 90.33,26.04 90.17,25.88 U7_MUX.4
U7_MUX_S0
  Top 0.152: U7_MUX.10 86.36,16.03 86.2,15.88 79.69,15.88 79.53,15.72 79.53,11.27 79.38,11.11 68.42,11.11 68.26,10.95 68.26,8.41 68.1,8.26 45.24,8.26 45.09,8.1 U$5.P38
U7_MUX_S1
  Top 0.152: U7_MUX.9 85.09,16.67 84.77,16.35 79.38,16.35 79.22,16.19 79.22,11.59 79.06,11.43 68.1,11.43 67.94,11.27 67.94,8.73 67.79,8.57 45.24,8.57 45.09,8.73 U$5.P37
U7RX
  Top 0.152: U7_MUX.13 90.17,15.56 90.01,15.4 80.01,15.4 79.85,15.24 79.85,10.95 79.69,10.79 68.74,10.79 68.58,10.64 68.58,8.1 68.42,7.94 47.78,7.94 47.62,7.78 U$5.P28
U7TX  (via drill 0.33 pad 0.69)
  Top 0.152: v86.36,18.57 79.06,18.57 78.9,18.41 78.9,11.91 78.74,11.75 67.79,11.75 67.63,11.59 67.63,9.05 67.47,8.89 47.78,8.89 47.62,9.05 U$5.P27 | v92.08,18.57 92.08,21.64 U7_MUX.3
  Bottom 0.152: v92.08,18.57 v86.36,18.57

### Text on the board
tNames: Sensor | !!! Caution !!! | !!! Caution !!! | !!! Caution !!! | !!! Caution !!! | .1uF | 5v | 12V